# Altium project fpga_pmu_pcb_board.PrjPcb (part 1 of 2)
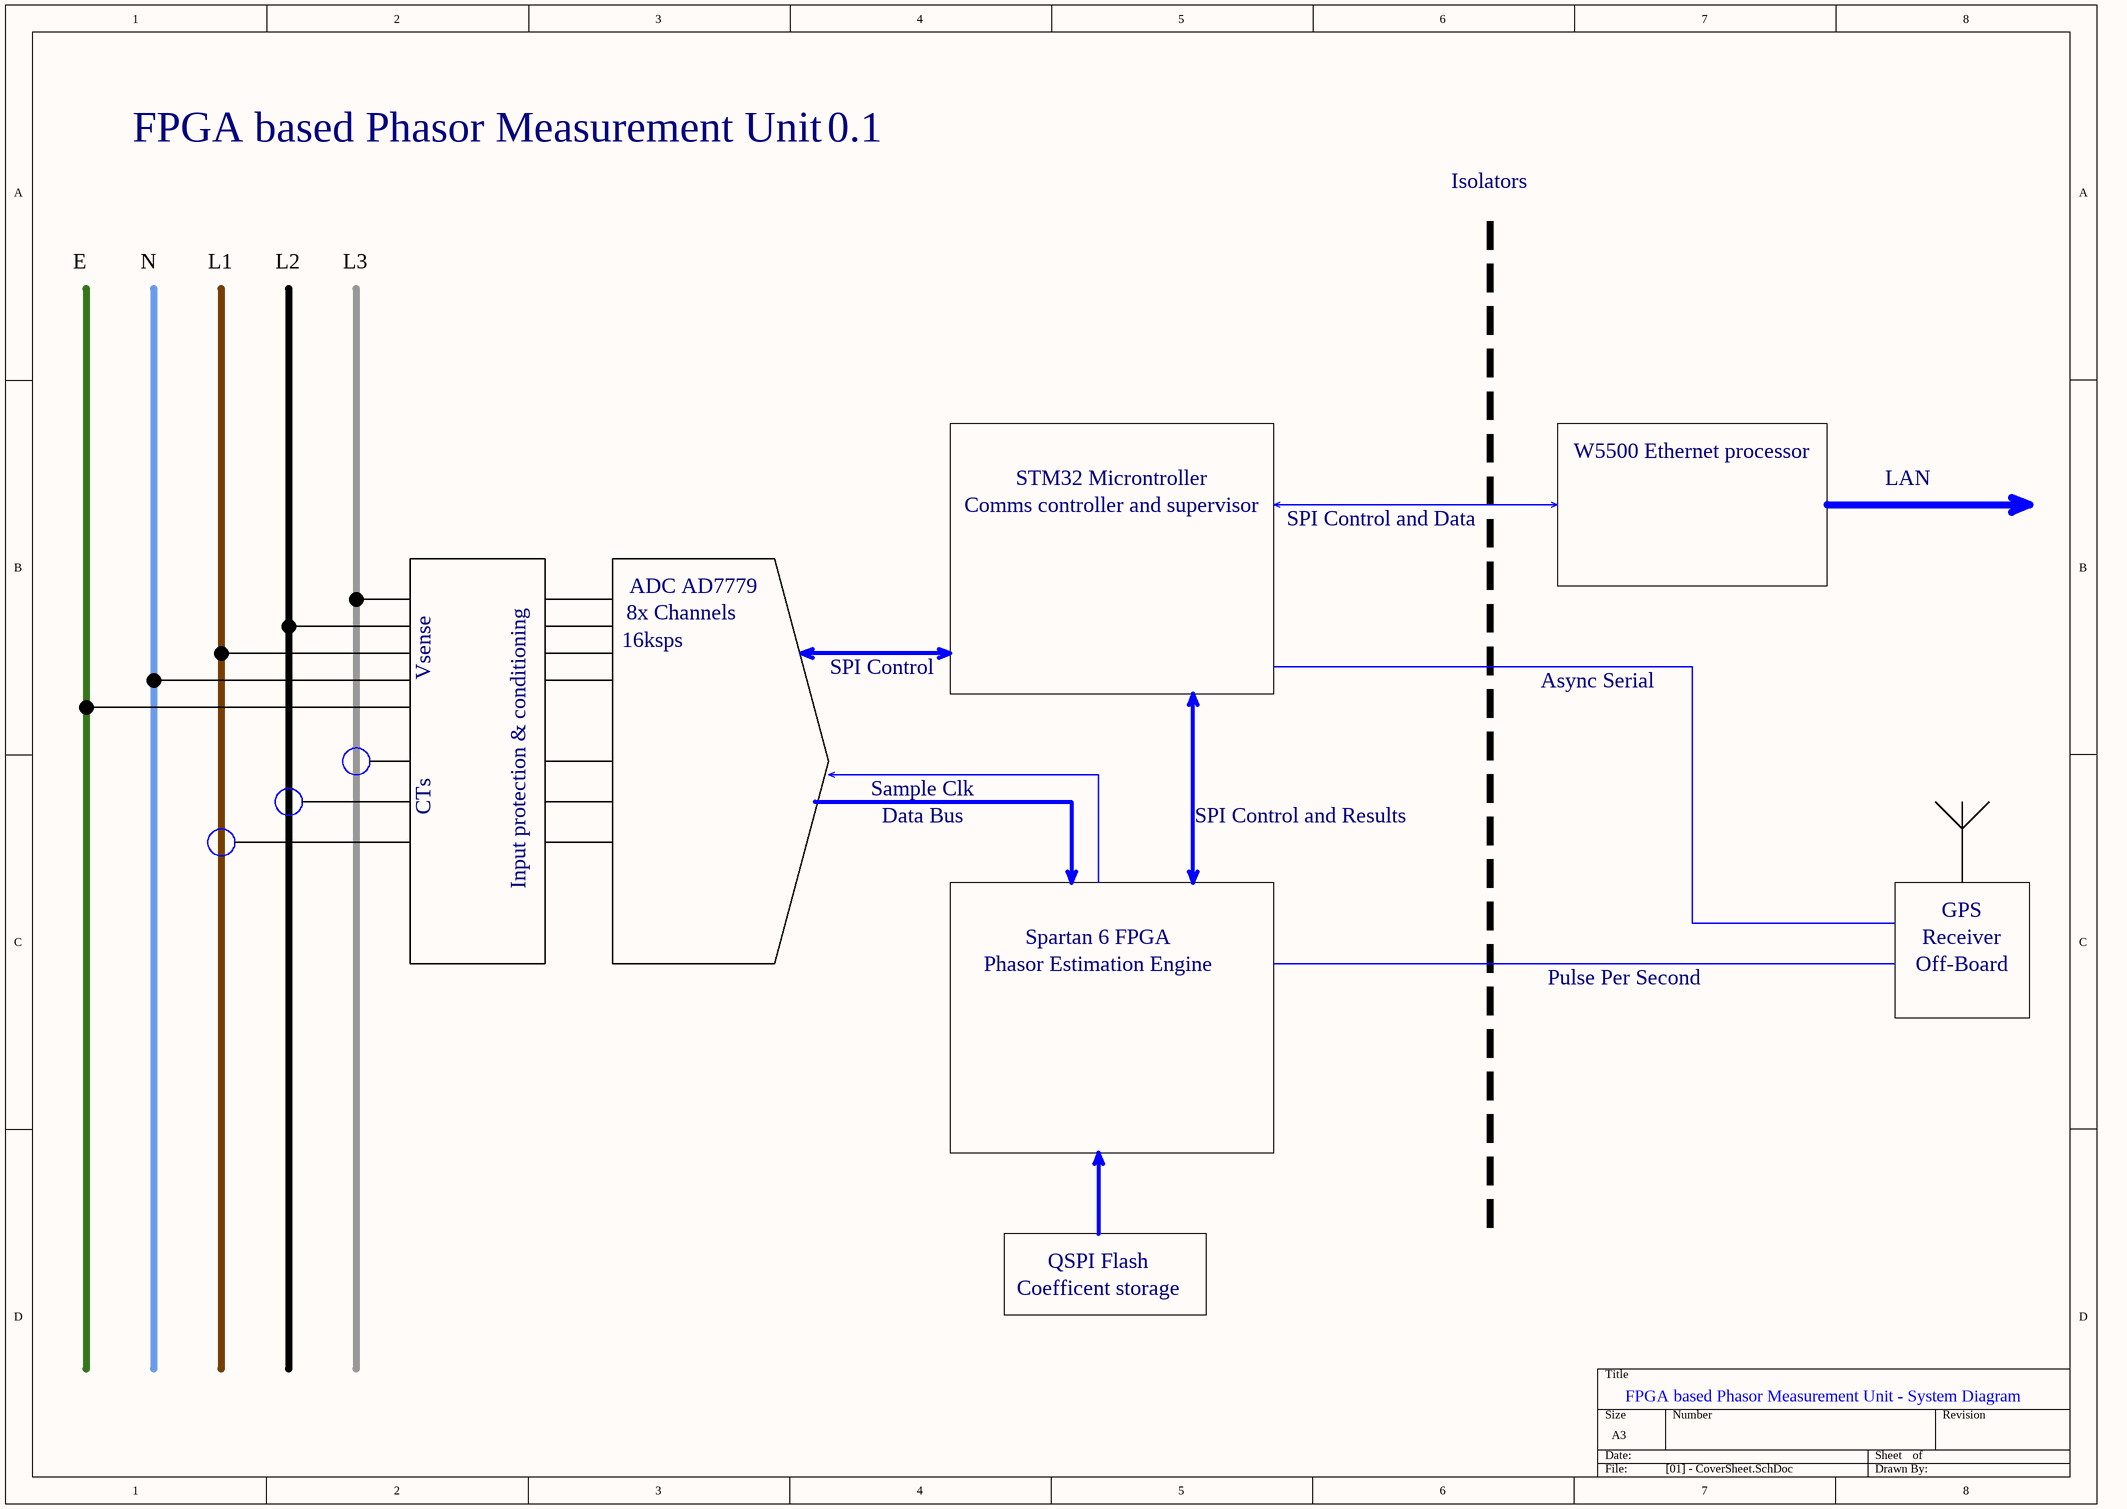
[diagram p0: [01] - CoverSheet.SchDoc]
ProjectName: FPGA PMU
10 sheets, 269 parts. Net scope: flat (ports and power ports of the same name join across sheets).
Board file: fpga_pmu_pcb_board.PcbDoc
Sheets:
  [01] - CoverSheet.SchDoc
  [02] - Notes.SchDoc
  [03] - HV Input.SchDoc
  [04] - Current Transformers.SchDoc
  [05] - ADC.SchDoc
  [06] - FPGA Aux.SchDoc
  [07] - FPGA IO.SchDoc
  [08] - Microcontroller.SchDoc
  [09] - Ethernet.SchDoc
  [10] - Isolation.SchDoc

## Sheet [01] - CoverSheet.SchDoc
size A3; Engineer: Derryn Harvie; Revision: 0.1; SheetNumber: 1

### Notes on the sheet
- FPGA based Phasor Measurement Unit
- Isolators
- E
- N
- L1
- L2
- L3
- W5500 Ethernet processor
- STM32 Microntroller
- Comms controller and supervisor
- SPI Control and Data
- LAN
- ADC AD7779
- 8x Channels
- 16ksps
- Vsense
- SPI Control
- Async Serial
- Input protection & conditioning
- Sample Clk
- CTs
- Data Bus
- SPI Control and Results
- GPS
- Spartan 6 FPGA
- Phasor Estimation Engine
- Pulse Per Second
- Receiver
- Off-Board
- QSPI Flash
- Coefficent storage
- FPGA based Phasor Measurement Unit - System Diagram

## Sheet [02] - Notes.SchDoc
size A4
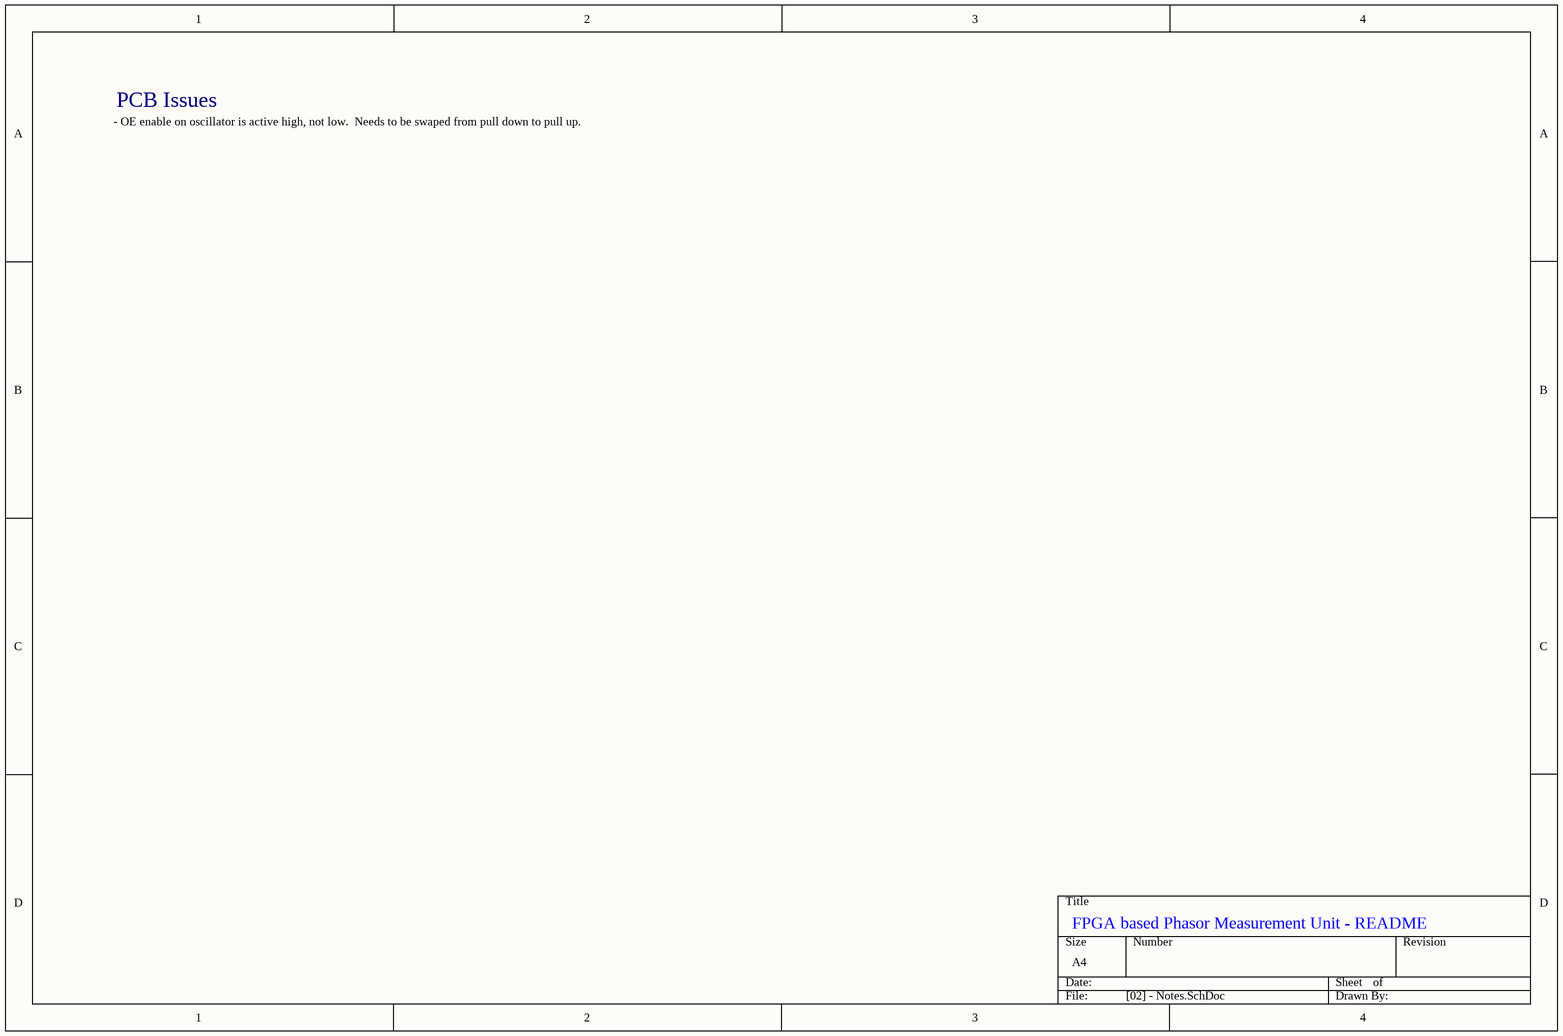
[diagram p1: [02] - Notes.SchDoc]

### Notes on the sheet
- PCB Issues
- - OE enable on oscillator is active high, not low.  Needs to be swaped from pull down to pull up.
- FPGA based Phasor Measurement Unit - README

## Sheet [03] - HV Input.SchDoc
size A3
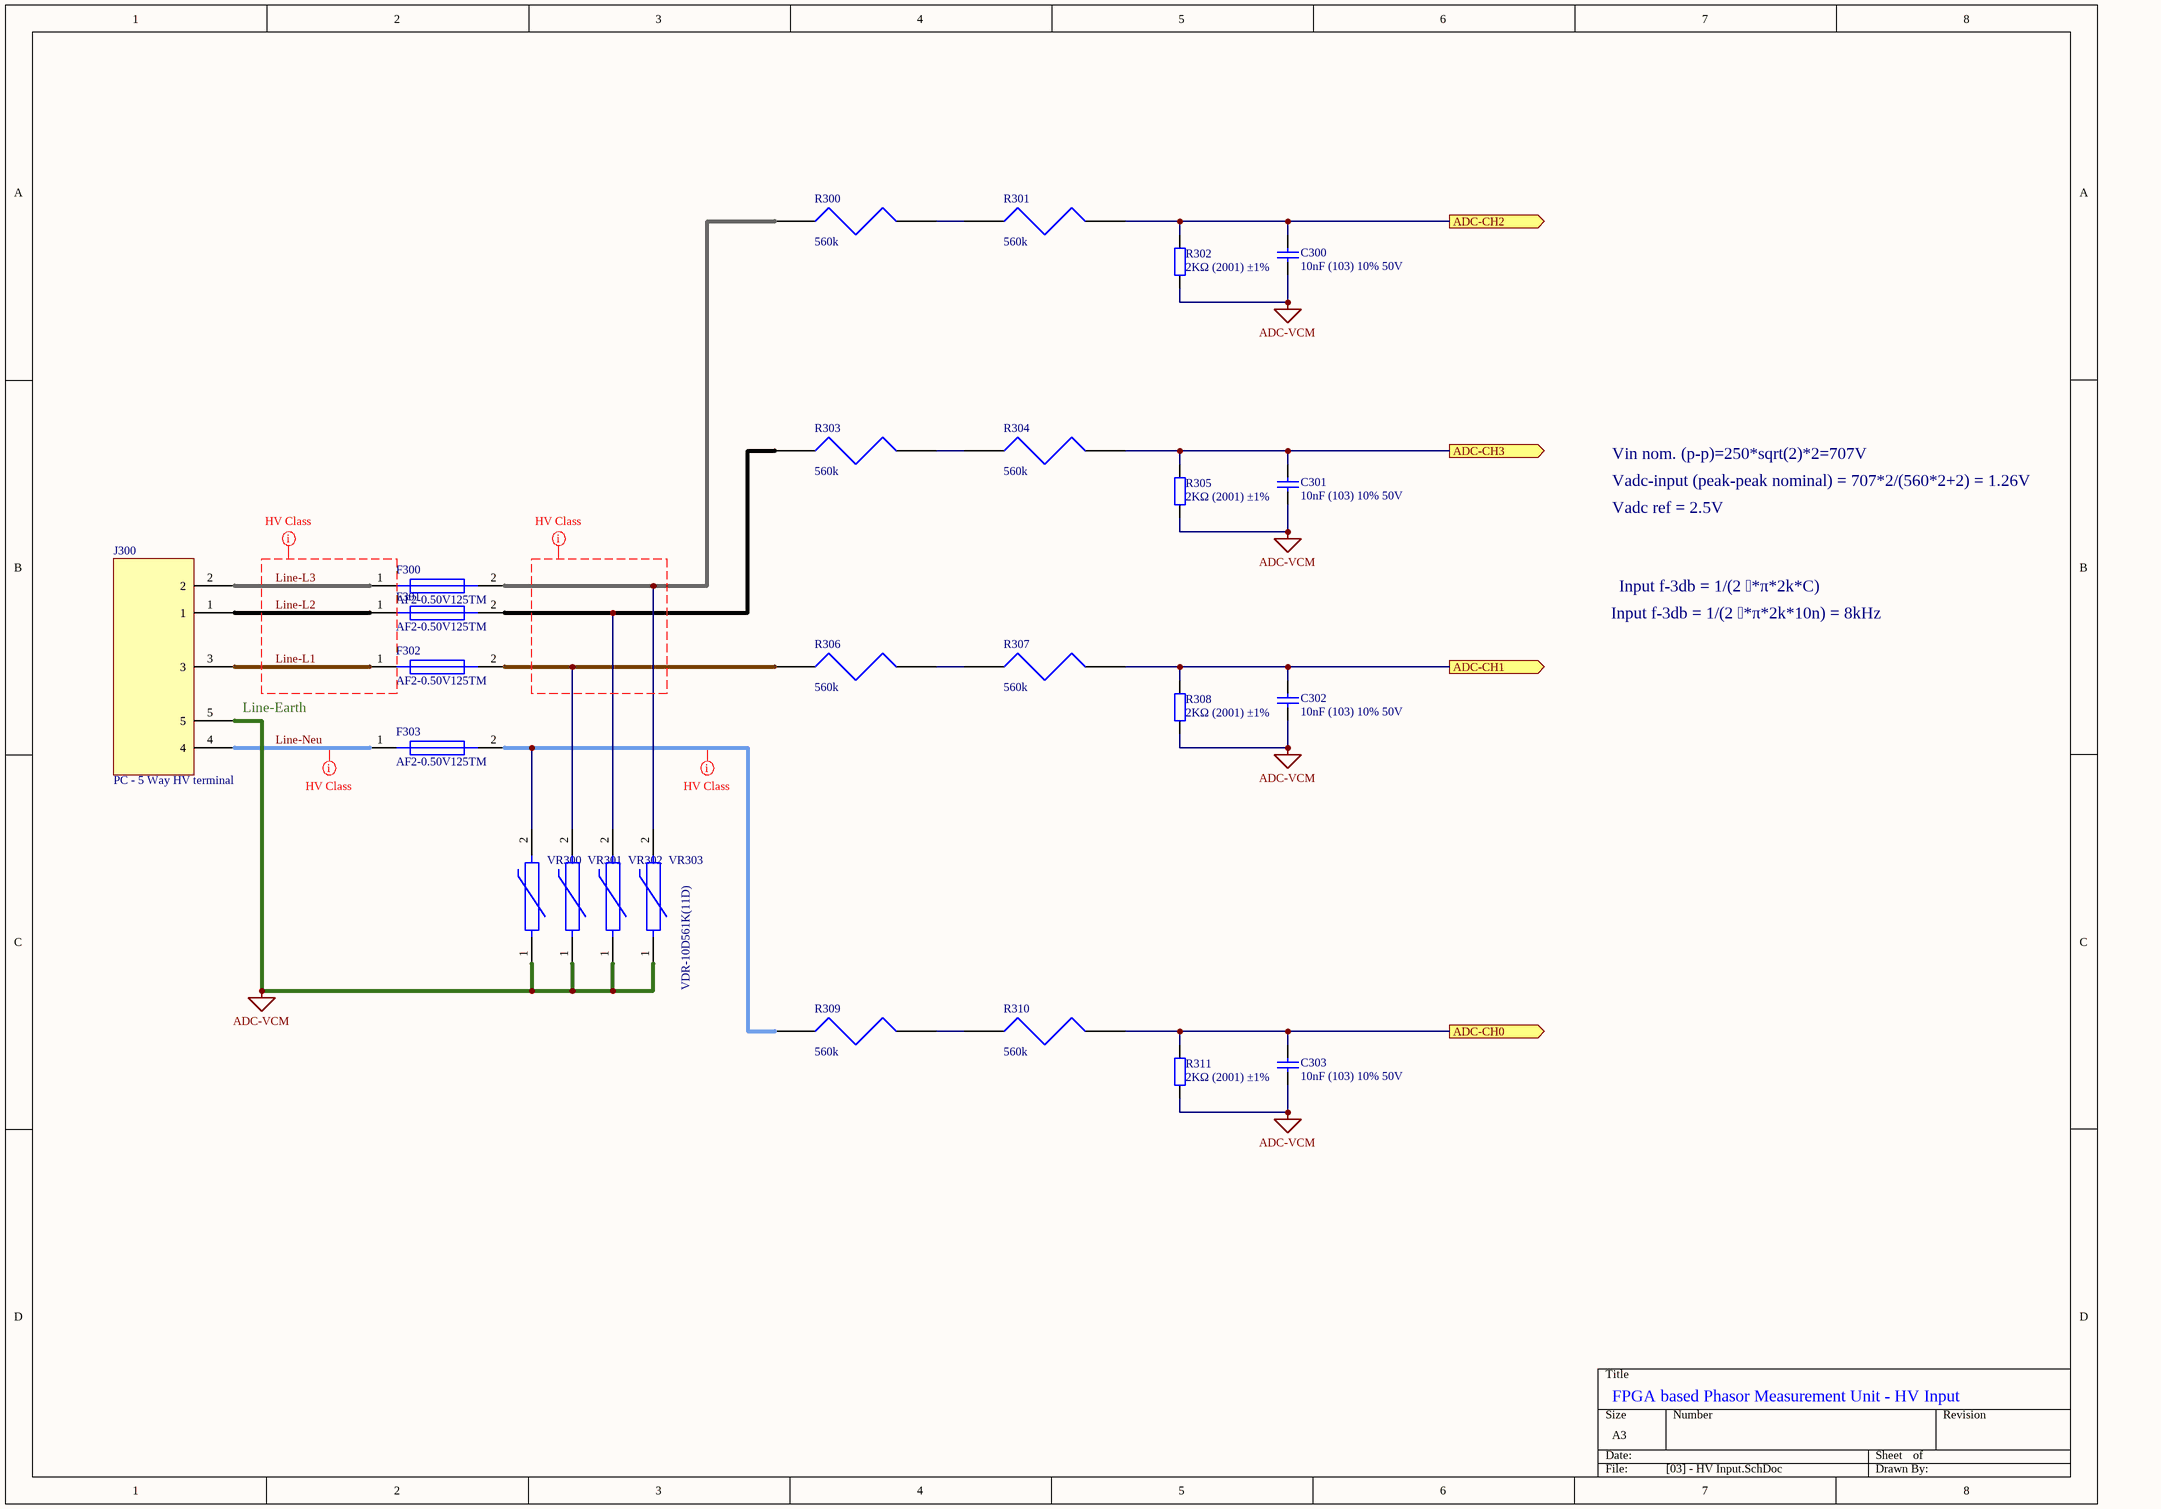
[diagram p2: [03] - HV Input.SchDoc]

### Parts
C300  10nF (103) 10% 50V  [0805_C]
C301  10nF (103) 10% 50V  [0805_C]
C302  10nF (103) 10% 50V  [0805_C]
C303  10nF (103) 10% 50V  [0805_C]
F300  AF2-0.50V125TM  [2410 Fuse]
F301  AF2-0.50V125TM  [2410 Fuse]
F302  AF2-0.50V125TM  [2410 Fuse]
F303  AF2-0.50V125TM  [2410 Fuse]
J300  PC - 5 Way HV terminal  [1017517]
R300  560k  [2512_HV_RES]
R301  560k  [2512_HV_RES]
R302  2KΩ (2001) ±1%  [0805_R]
R303  560k  [2512_HV_RES]
R304  560k  [2512_HV_RES]
R305  2KΩ (2001) ±1%  [0805_R]
R306  560k  [2512_HV_RES]
R307  560k  [2512_HV_RES]
R308  2KΩ (2001) ±1%  [0805_R]
R309  560k  [2512_HV_RES]
R310  560k  [2512_HV_RES]
R311  2KΩ (2001) ±1%  [0805_R]
VR300  VDR-10D561K(11D)  [VDR-10D561K(11D)]  (value not drawn)
VR301  VDR-10D561K(11D)  [VDR-10D561K(11D)]  (value not drawn)
VR302  VDR-10D561K(11D)  [VDR-10D561K(11D)]  (value not drawn)
VR303  VDR-10D561K(11D)  [VDR-10D561K(11D)]

### Ports
ADC-CH0 (out), ADC-CH1 (out), ADC-CH2 (out), ADC-CH3 (out)

### Nets
ADC-VCM: C300.1 C301.1 C302.1 C303.1 J300.5 R302.1 R305.1 R308.1 R311.1 VR300.1 VR301.1 VR302.1 VR303.1
Line-L1: F302.1 J300.3
Line-L2: F301.1 J300.1
Line-L3: F300.1 J300.2
Line-Neu: F303.1 J300.4
NetC300_2: C300.2 R301.2 R302.2 ; port ADC-CH2
NetC301_2: C301.2 R304.2 R305.2 ; port ADC-CH3
NetC302_2: C302.2 R307.2 R308.2 ; port ADC-CH1
NetC303_2: C303.2 R310.2 R311.2 ; port ADC-CH0
NetF300_2: F300.2 R300.1 VR303.2
NetF301_2: F301.2 R303.1 VR302.2
NetF302_2: F302.2 R306.1 VR301.2
NetF303_2: F303.2 R309.1 VR300.2
NetR300_2: R300.2 R301.1
NetR303_2: R303.2 R304.1
NetR306_2: R306.2 R307.1
NetR309_2: R309.2 R310.1

### Layout directives
net class HV: (no net found under the mark), Line-L1, Line-L2, Line-L3, Line-Neu, NetF303_2

### Notes on the sheet
- Vin nom. (p-p)=250*sqrt(2)*2=707V
- Vadc-input (peak-peak nominal) = 707*2/(560*2+2) = 1.26V
- Vadc ref = 2.5V
- Input f-3db = 1/(2 *π*2k*C)
- Input f-3db = 1/(2 *π*2k*10n) = 8kHz
- (near J300) Line-Earth
- FPGA based Phasor Measurement Unit - HV Input

### Library data of the parts
C300-C303 = 0805 10nF (103) 10% 50V: 贴片电容; ComponentLink1Description: 供应商链接; ComponentLink1URL: http://www.szlcsc.com/product/details_2062.html; Package: 0805; Supplier: LC; SuppliersPartNumber: C1710
F300-F303 = AF2-0.50V125TM: Chip Fuse Fast Blow 500mA 231mΩ 100A AC，50A DC 0.1 2410 Surface Mount Fuses RoHS; SuppliersPartNo: C311009; JLCPCB: NO
J300 = PC - 5 Way HV terminal: TDPT 4/ 5-SC-6,35-ZB - 1017517; JLCPCB: NO
R300 R301 R303 R304 R306 R307 R309 R310 = HR2512F560KE04Z: HIGH VOLTAGE RESISTOR 560KOHMS ±1% 1W 2512 ROHS; Value: 560k; Supplier: LCSC; SuppliersPartNumber: C175529
R302 R305 R308 R311 = 0805 2KΩ (2001) 1%: 贴片电阻; ComponentLink1Description: 供应商链接; ComponentLink1URL: http://www.szlcsc.com/product/details_18292.html; Package: 0805; Supplier: LC; SuppliersPartNumber: C17604
VR300-VR303 = VDR-10D561K(11D): 460V 920V 2.5KA 560V Through Hole Varistors RoHS; SuppliersPartNo: C283943; JLCPCB: NO

## Sheet [04] - Current Transformers.SchDoc
size A3
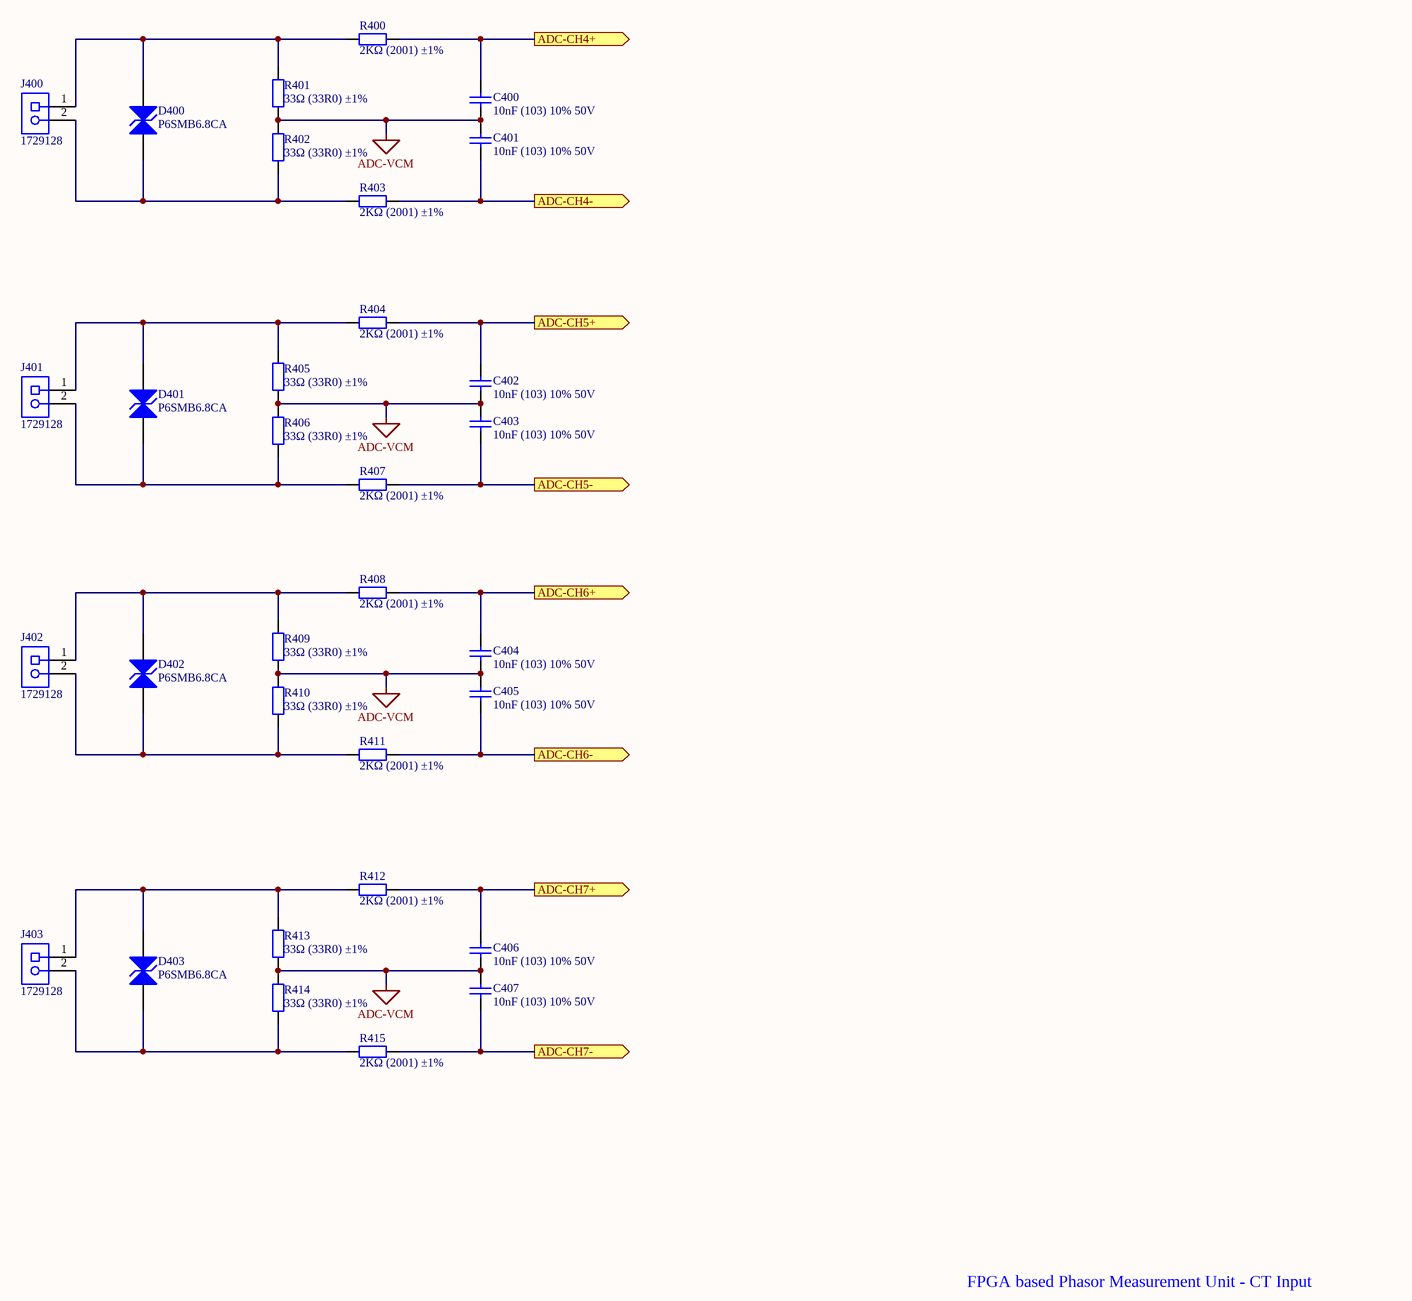
[diagram p3: [04] - Current Transformers.SchDoc]

### Parts
C400  10nF (103) 10% 50V  [0805_C]
C401  10nF (103) 10% 50V  [0805_C]
C402  10nF (103) 10% 50V  [0805_C]
C403  10nF (103) 10% 50V  [0805_C]
C404  10nF (103) 10% 50V  [0805_C]
C405  10nF (103) 10% 50V  [0805_C]
C406  10nF (103) 10% 50V  [0805_C]
C407  10nF (103) 10% 50V  [0805_C]
D400  P6SMB6.8CA  [SMB(DO-214AA)_S1]
D401  P6SMB6.8CA  [SMB(DO-214AA)_S1]
D402  P6SMB6.8CA  [SMB(DO-214AA)_S1]
D403  P6SMB6.8CA  [SMB(DO-214AA)_S1]
J400  1729128  [PHOE-1729128-2_V]
J401  1729128  [PHOE-1729128-2_V]
J402  1729128  [PHOE-1729128-2_V]
J403  1729128  [PHOE-1729128-2_V]
R400  2KΩ (2001) ±1%  [0805_R]
R401  33Ω (33R0) ±1%  [0603_R]
R402  33Ω (33R0) ±1%  [0603_R]
R403  2KΩ (2001) ±1%  [0805_R]
R404  2KΩ (2001) ±1%  [0805_R]
R405  33Ω (33R0) ±1%  [0603_R]
R406  33Ω (33R0) ±1%  [0603_R]
R407  2KΩ (2001) ±1%  [0805_R]
R408  2KΩ (2001) ±1%  [0805_R]
R409  33Ω (33R0) ±1%  [0603_R]
R410  33Ω (33R0) ±1%  [0603_R]
R411  2KΩ (2001) ±1%  [0805_R]
R412  2KΩ (2001) ±1%  [0805_R]
R413  33Ω (33R0) ±1%  [0603_R]
R414  33Ω (33R0) ±1%  [0603_R]
R415  2KΩ (2001) ±1%  [0805_R]

### Ports
ADC-CH4+ (out), ADC-CH4- (out), ADC-CH5+ (out), ADC-CH5- (out), ADC-CH6+ (out), ADC-CH6- (out), ADC-CH7+ (out), ADC-CH7- (out)

### Nets
ADC-VCM: C400.1 C401.2 C402.1 C403.2 C404.1 C405.2 C406.1 C407.2 R401.1 R402.2 R405.1 R406.2 R409.1 R410.2 R413.1 R414.2
NetC400_2: C400.2 R400.1 ; port ADC-CH4+
NetC401_1: C401.1 R403.1 ; port ADC-CH4-
NetC402_2: C402.2 R404.1 ; port ADC-CH5+
NetC403_1: C403.1 R407.1 ; port ADC-CH5-
NetC404_2: C404.2 R408.1 ; port ADC-CH6+
NetC405_1: C405.1 R411.1 ; port ADC-CH6-
NetC406_2: C406.2 R412.1 ; port ADC-CH7+
NetC407_1: C407.1 R415.1 ; port ADC-CH7-
NetD400_1: D400.1(A) J400.2 R402.1 R403.2
NetD400_2: D400.2(K) J400.1 R400.2 R401.2
NetD401_1: D401.1(A) J401.2 R406.1 R407.2
NetD401_2: D401.2(K) J401.1 R404.2 R405.2
NetD402_1: D402.1(A) J402.2 R410.1 R411.2
NetD402_2: D402.2(K) J402.1 R408.2 R409.2
NetD403_1: D403.1(A) J403.2 R414.1 R415.2
NetD403_2: D403.2(K) J403.1 R412.2 R413.2

### Notes on the sheet
- FPGA based Phasor Measurement Unit - CT Input

### Library data of the parts
C400-C407 = 0805 10nF (103) 10% 50V: 贴片电容; ComponentLink1Description: 供应商链接; ComponentLink1URL: http://www.szlcsc.com/product/details_2062.html; Package: 0805; Supplier: LC; SuppliersPartNumber: C1710
D400-D403 = SMB/DO-214AA P6SMB6.8CA: TVS; ComponentLink1Description: 供应商链接; ComponentLink1URL: http://www.szlcsc.com/product/details_79530.html; Package: SMB/DO-214AA; Supplier: LC; SuppliersPartNumber: C78395
J400-J403 = CMP-2000-05815-1: PCB Terminal Block, 13.5 A, 400 V, 2-Pin THD, RoHS, Bulk; Manufacturer: Phoenix Contact; Package Version: 03/2015; No. of Rows: 1; Pitch: 5.08mm; No. of Positions: 2; Voltage Rating: 400V; Current Rating: 13500mA; Manufacturer URL: http://www.phoenixcontact.com/; Datasheet URL: https://datasheet.ciiva.com/16046/1729128-16046181.pdf; RoHS: TRUE; Package URL: https://www.phoenixcontact.com/online/portal/pi/pxc/product_detail_page/!ut/p/b1/3VdJjqNKFDxLH8AFycySyWY2ozFsEPOMMQaDOX1XedGL_1Vdm5YXJleknhSKeBkvI6EA8ncAo3AYoDhBQGco6KN7VURTdemj9us_IEKEZo_YHiPAEWEFmDGOHMORkqKYCORBZxgL7ZoaZYcbFFUZ3fqxSY6GOuxydWUuHqz1ynmMFygu583Bob0Ewr6Sd_l-5m-kAueHiB0jpRwZwe58wwtkpxtMYd_LmGcDRU02dRNEyWt6Y2ti5pSyJ_reIkzIulrqApdnbT11V5jnCKbYNCvhEM1MCpPByat_X379-iThf08CI5GfOPqfBeS3BRoBOdD55AKVv0iLwCMq-2BrzXWSGRH7pUGD9uwXQjiph3xL0DKQwdGa0JImiIOmBNOestqgwTHSSs2oOep-78apyXQBvNi8ZLaFjvjWvcaUEBu0MC6Wbe-d6mB0FAebo2lUWinqYaZs5DAYzV0RP9yitUjnGJ0iI9xhZkT42OCQNUJJhkgWINNQLP2JFP6OpMg3JCVg70jqHT0lvKOnhHf0lPuOnnLf0VPuWx6_dxwUIvwk5WMkT0kLL1mh61l2yZVSzG3pYV_bqo-mj6uMKwKwdnnW8Jh5RTOJzMOA5c-eJDaZQw4mTMPH02PvS_ZAqNVjVTo2WyYLkwH_KU1mmmG5kjRhDqPXLwwVHvVOjCM60-fpXvTDfMGW1PVFVS1r4e4yVDk4ZdNbkUHvqPqQSeian4UD39fNKmachqdJ1NJbyk8rXT9mXTvPk3oE5meulKGgiruPJek-4I9hTT6G8ZLOyRSm2RRVbThERQad5OS28hdt4YW4vG0stgYYzsWsK4_7y6DZMjJSCqri1kyiZR5vD7pwIrNR7QwPHTcLTI5qT7eRlpHrdGiupYlqQDJ7zy_CND8fWWBoLRXxk1RVcXiBQwbTD4Xi7KL-FuO94t9xaqweXzH; PartNumber: 1729128; Package Description: 2-Pin Through Hole Device, Body 8.1 x 10.16 mm, Pitch 5.08 mm; Datasheet Version: 12/2013; Mounting Technology: ThroughHole; Orientation: Horizontal; Package Reference: 1729128-2; Packing: Bulk; JLCPCB: NO
R400 R403 R404 R407 R408 R411 R412 R415 = 0805 2KΩ (2001) 1%: 贴片电阻; ComponentLink1Description: 供应商链接; ComponentLink1URL: http://www.szlcsc.com/product/details_18292.html; Package: 0805; Supplier: LC; SuppliersPartNumber: C17604
R401 R402 R405 R406 R409 R410 R413 R414 = 0603 33Ω (33R0) 1%: 贴片电阻; ComponentLink1Description: 供应商链接; ComponentLink1URL: http://www.szlcsc.com/product/details_23867.html; Package: 0603; Supplier: LC; SuppliersPartNumber: C23140

## Sheet [05] - ADC.SchDoc
size A3
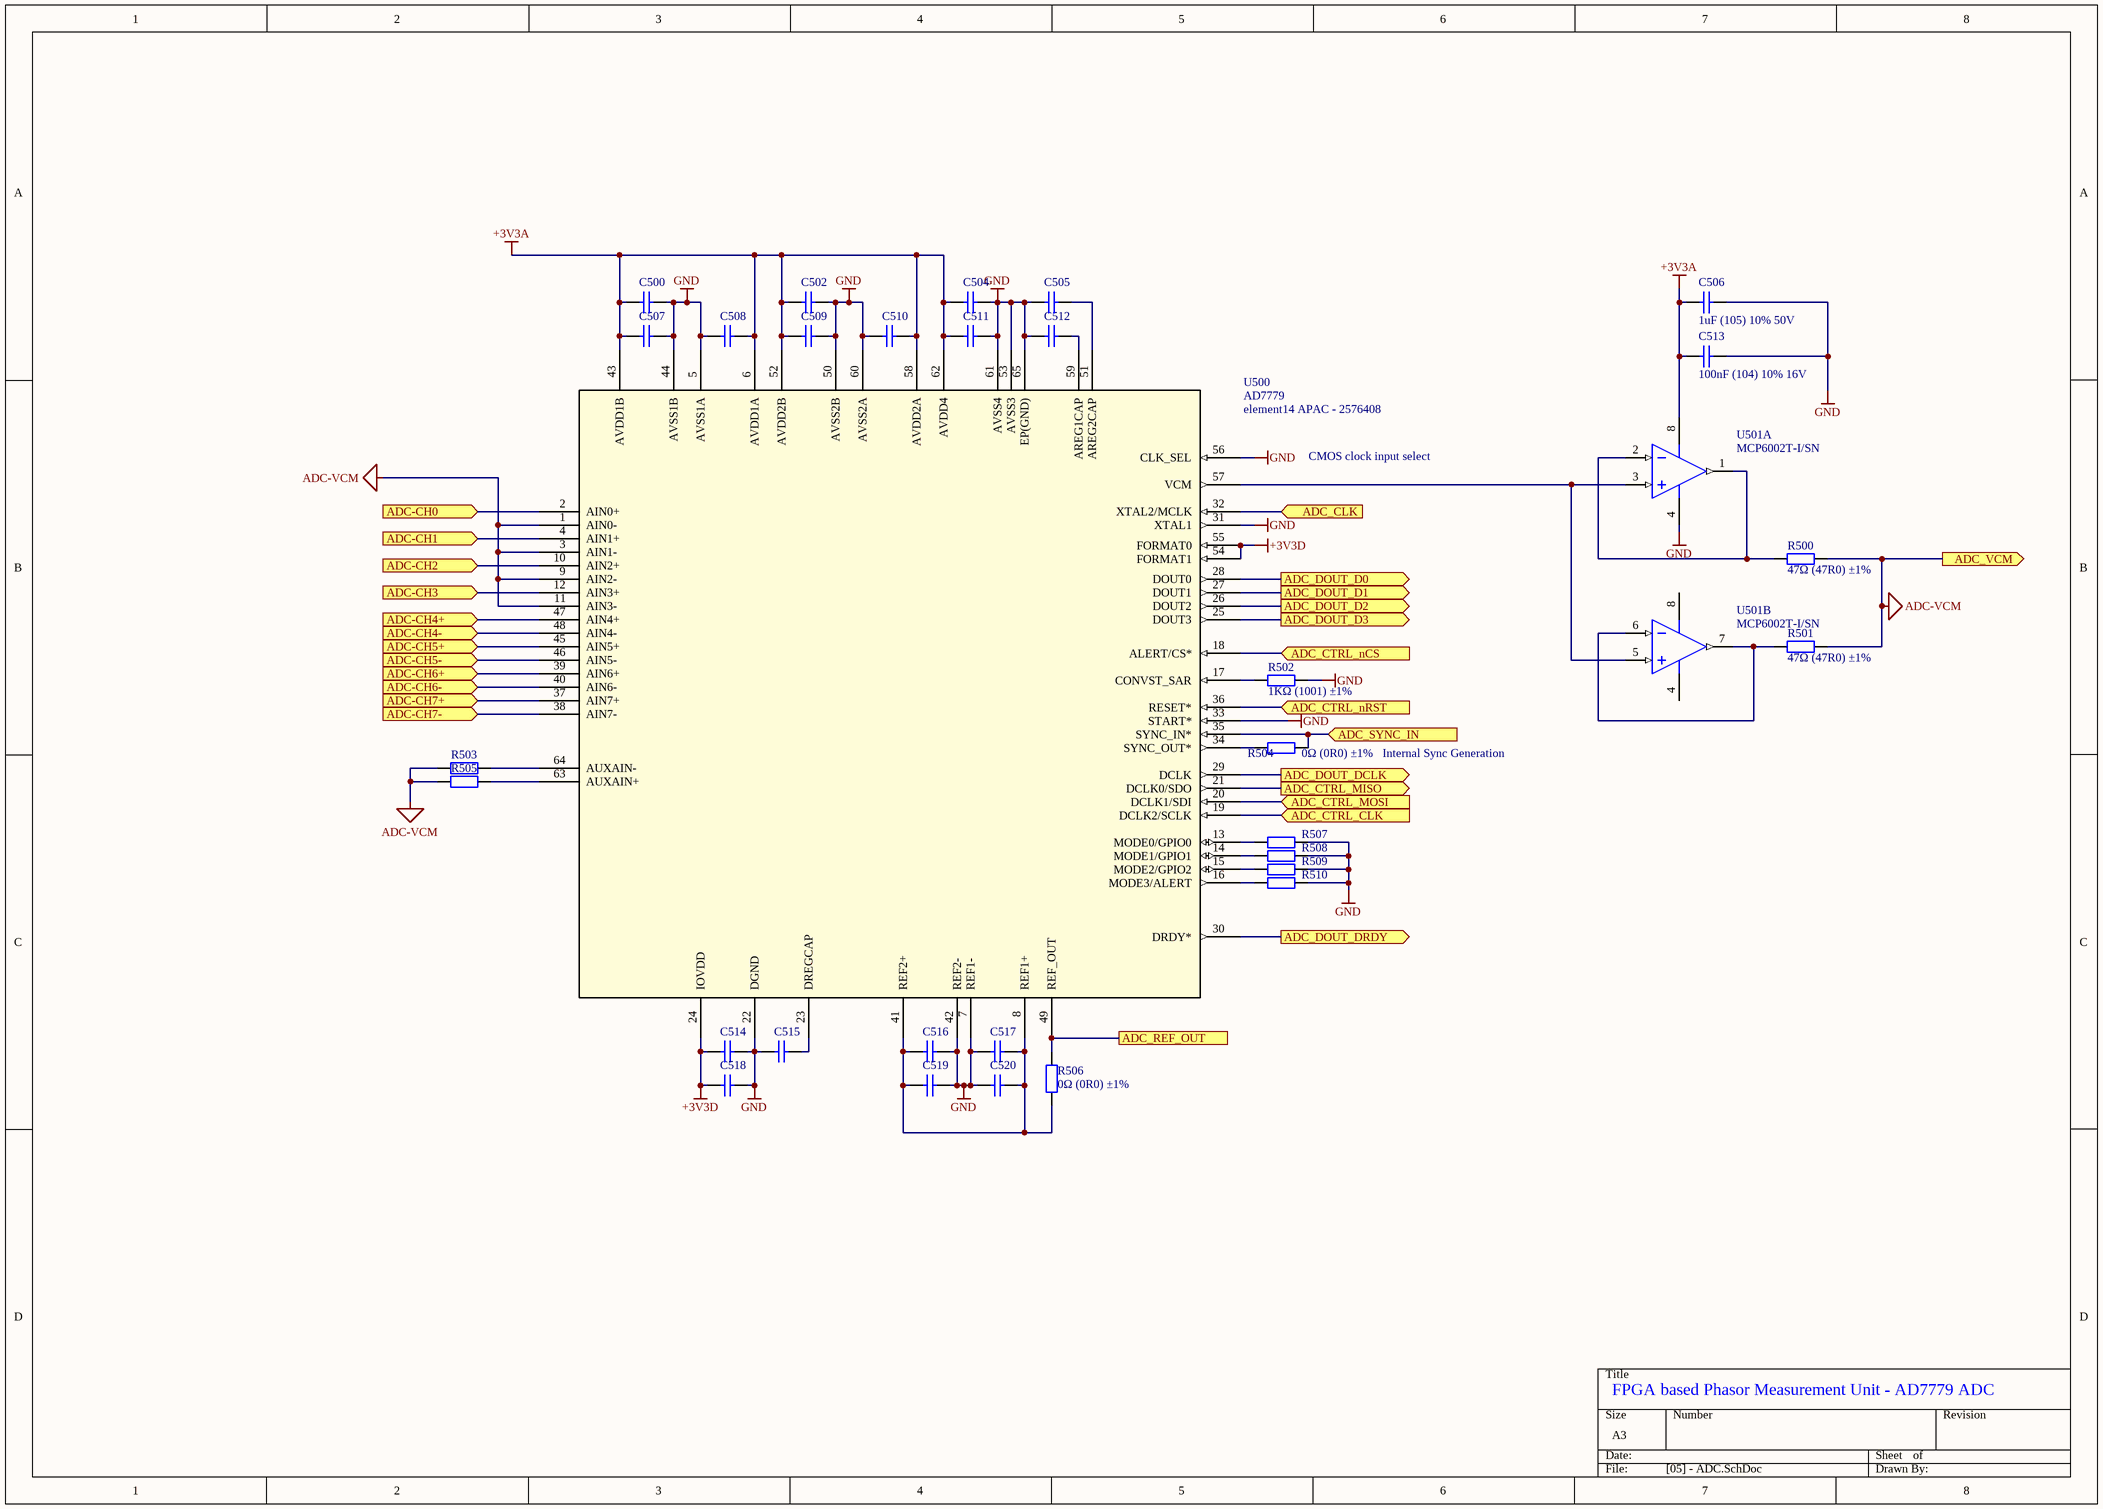
[diagram p4: [05] - ADC.SchDoc]

### Parts
C500  1uF (105) 10% 50V  [0603_C]  (value not drawn)
C502  1uF (105) 10% 50V  [0603_C]  (value not drawn)
C504  1uF (105) 10% 50V  [0603_C]  (value not drawn)
C505  100nF (104) 10% 16V  [0402_C]  (value not drawn)
C506  1uF (105) 10% 50V  [0603_C]
C507  100nF (104) 10% 16V  [0402_C]  (value not drawn)
C508  100nF (104) 10% 16V  [0402_C]  (value not drawn)
C509  100nF (104) 10% 16V  [0402_C]  (value not drawn)
C510  100nF (104) 10% 16V  [0402_C]  (value not drawn)
C511  100nF (104) 10% 16V  [0402_C]  (value not drawn)
C512  100nF (104) 10% 16V  [0402_C]  (value not drawn)
C513  100nF (104) 10% 16V  [0402_C]
C514  100nF (104) 10% 16V  [0402_C]  (value not drawn)
C515  100nF (104) 10% 16V  [0402_C]  (value not drawn)
C516  100nF (104) 10% 16V  [0402_C]  (value not drawn)
C517  100nF (104) 10% 16V  [0402_C]  (value not drawn)
C518  1uF (105) 10% 50V  [0603_C]  (value not drawn)
C519  1uF (105) 10% 50V  [0603_C]  (value not drawn)
C520  1uF (105) 10% 50V  [0603_C]  (value not drawn)
R500  47Ω (47R0) ±1%  [0603_R]
R501  47Ω (47R0) ±1%  [0603_R]
R502  1KΩ (1001) ±1%  [0402_R]
R503  1KΩ (1001) ±1%  [0402_R]  (value not drawn)
R504  0Ω (0R0) ±1%  [0402_R]
R505  1KΩ (1001) ±1%  [0402_R]  (value not drawn)
R506  0Ω (0R0) ±1%  [0402_R]
R507  1KΩ (1001) ±1%  [0402_R]  (value not drawn)
R508  1KΩ (1001) ±1%  [0402_R]  (value not drawn)
R509  1KΩ (1001) ±1%  [0402_R]  (value not drawn)
R510  1KΩ (1001) ±1%  [0402_R]  (value not drawn)
U500  AD7779  Supplier Part Number 1: element14 APAC - 2576408  [CP_64_15]
U501  MCP6002T-I/SN  [SOIC-8_150mil]  (parts A,B of 2)

### Ports
ADC-CH0 (in), ADC-CH1 (in), ADC-CH2 (in), ADC-CH3 (in), ADC-CH4+ (in), ADC-CH4- (in), ADC-CH5+ (in), ADC-CH5- (in), ADC-CH6+ (in), ADC-CH6- (in), ADC-CH7+ (in), ADC-CH7- (in), ADC_CLK (in), ADC_CTRL_CLK (in), ADC_CTRL_MISO (out), ADC_CTRL_MOSI (in), ADC_CTRL_nCS (in), ADC_CTRL_nRST (in), ADC_DOUT_D0 (out), ADC_DOUT_D1 (out), ADC_DOUT_D2 (out), ADC_DOUT_D3 (out), ADC_DOUT_DCLK (out), ADC_DOUT_DRDY (out), ADC_REF_OUT, ADC_SYNC_IN (in), ADC_VCM (out)

### Nets
+3V3A: C500.1 C502.1 C504.1 C506.1 C507.1 C508.2 C509.1 C510.2 C511.1 C513.1 U500.6(AVDD1A) U500.43(AVDD1B) U500.52(AVDD2B) U500.58(AVDD2A) U500.62(AVDD4) U501.8(VDD)
+3V3D: C514.1 C518.1 U500.24(IOVDD) U500.54(FORMAT1) U500.55(FORMAT0)
ADC-VCM: R500.2 R501.2 R503.1 R505.1 U500.1(AIN0-) U500.3(AIN1-) U500.9(AIN2-) U500.11(AIN3-) ; port ADC_VCM
GND: C500.2 C502.2 C504.2 C505.1 C506.2 C507.2 C508.1 C509.2 C510.1 C511.2 C512.1 C513.2 C514.2 C515.1 C516.2 C517.1 C518.2 C519.2 C520.1 R502.2 R507.2 R508.2 R509.2 R510.2 U500.5(AVSS1A) U500.7(REF1-) U500.22(DGND) U500.31(XTAL1) U500.33(START*) U500.42(REF2-) U500.44(AVSS1B) U500.50(AVSS2B) U500.53(AVSS3) U500.56(CLK_SEL) U500.60(AVSS2A) U500.61(AVSS4) U500.65(EP(GND)) U501.4(VSS)
NetC300_2: U500.10(AIN2+) ; port ADC-CH2
NetC301_2: U500.12(AIN3+) ; port ADC-CH3
NetC302_2: U500.4(AIN1+) ; port ADC-CH1
NetC303_2: U500.2(AIN0+) ; port ADC-CH0
NetC400_2: U500.47(AIN4+) ; port ADC-CH4+
NetC401_1: U500.48(AIN4-) ; port ADC-CH4-
NetC402_2: U500.45(AIN5+) ; port ADC-CH5+
NetC403_1: U500.46(AIN5-) ; port ADC-CH5-
NetC404_2: U500.39(AIN6+) ; port ADC-CH6+
NetC405_1: U500.40(AIN6-) ; port ADC-CH6-
NetC406_2: U500.37(AIN7+) ; port ADC-CH7+
NetC407_1: U500.38(AIN7-) ; port ADC-CH7-
NetC505_2: C505.2 U500.51(AREG2CAP)
NetC512_2: C512.2 U500.59(AREG1CAP)
NetC515_2: C515.2 U500.23(DREGCAP)
NetC516_1: C516.1 C517.2 C519.1 C520.2 R506.1 U500.8(REF1+) U500.41(REF2+)
NetR500_1: R500.1 U501.1(VOUTA) U501.2(VINA-)
NetR501_1: R501.1 U501.6(VINB-) U501.7(VOUTB)
NetR502_1: R502.1 U500.17(CONVST_SAR)
NetR503_2: R503.2 U500.64(AUXAIN-)
NetR504_1: R504.1 U500.34(SYNC_OUT*)
NetR504_2: R504.2 U500.35(SYNC_IN*) ; port ADC_SYNC_IN
NetR505_2: R505.2 U500.63(AUXAIN+)
NetR506_2: R506.2 U500.49(REF_OUT) ; port ADC_REF_OUT
NetR507_1: R507.1 U500.13(MODE0/GPIO0)
NetR508_1: R508.1 U500.14(MODE1/GPIO1)
NetR509_1: R509.1 U500.15(MODE2/GPIO2)
NetR510_1: R510.1 U500.16(MODE3/ALERT)
NetU500_18: U500.18(ALERT/CS*) ; port ADC_CTRL_nCS
NetU500_19: U500.19(DCLK2/SCLK) ; port ADC_CTRL_CLK
NetU500_20: U500.20(DCLK1/SDI) ; port ADC_CTRL_MOSI
NetU500_21: U500.21(DCLK0/SDO) ; port ADC_CTRL_MISO
NetU500_25: U500.25(DOUT3) ; port ADC_DOUT_D3
NetU500_26: U500.26(DOUT2) ; port ADC_DOUT_D2
NetU500_27: U500.27(DOUT1) ; port ADC_DOUT_D1
NetU500_28: U500.28(DOUT0) ; port ADC_DOUT_D0
NetU500_29: U500.29(DCLK) ; port ADC_DOUT_DCLK
NetU500_30: U500.30(DRDY*) ; port ADC_DOUT_DRDY
NetU500_32: U500.32(XTAL2/MCLK) ; port ADC_CLK
NetU500_36: U500.36(RESET*) ; port ADC_CTRL_nRST
NetU500_57: U500.57(VCM) U501.3(VINA+) U501.5(VINB+)

### Notes on the sheet
- CMOS clock input select
- Internal Sync Generation
- FPGA based Phasor Measurement Unit - AD7779 ADC

### Library data of the parts
C500 C502 C504 C506 C518-C520 = 0603 1uF (105) 10% 50V: 贴片电容; ComponentLink1Description: 供应商链接; ComponentLink1URL: http://www.szlcsc.com/product/details_16531.html; Package: 0603; Supplier: LC; SuppliersPartNumber: C15849
C505 C507-C517 = 0402 100nF (104) 10% 16V: 贴片电容; ComponentLink1Description: 供应商链接; ComponentLink1URL: http://www.szlcsc.com/product/details_1877.html; Package: 0402; Supplier: LC; SuppliersPartNumber: C1525
R500 R501 = 0603 47Ω (47R0) 1%: 贴片电阻; ComponentLink1Description: 供应商链接; ComponentLink1URL: http://www.szlcsc.com/product/details_23909.html; Package: 0603; Supplier: LC; SuppliersPartNumber: C23182
R502 R503 R505 R507-R510 = 0402 1KΩ (1001) 1%: 贴片电阻; ComponentLink1Description: 供应商链接; ComponentLink1URL: http://www.szlcsc.com/product/details_12256.html; Package: 0402; Supplier: LC; SuppliersPartNumber: C11702
R504 R506 = 0402 0Ω (0R0) 1%: 贴片电阻; ComponentLink1Description: 供应商链接; ComponentLink1URL: http://www.szlcsc.com/product/details_17853.html; Package: 0402; Supplier: LC; SuppliersPartNumber: C17168
U500 = AD7779ACPZ: ADC - 8 Channel; Supplier 1: Octopart; JLCPCB: NO
U501 = MCP6002T-I/SN_[C7377]: 运放; ComponentLink1Description: 供应商链接; ComponentLink1URL: http://www.szlcsc.com/product/details_7854.html; Package: SOIC-8_150mil; Supplier: LC; SuppliersPartNumber: C7377

## Sheet [06] - FPGA Aux.SchDoc
size A3
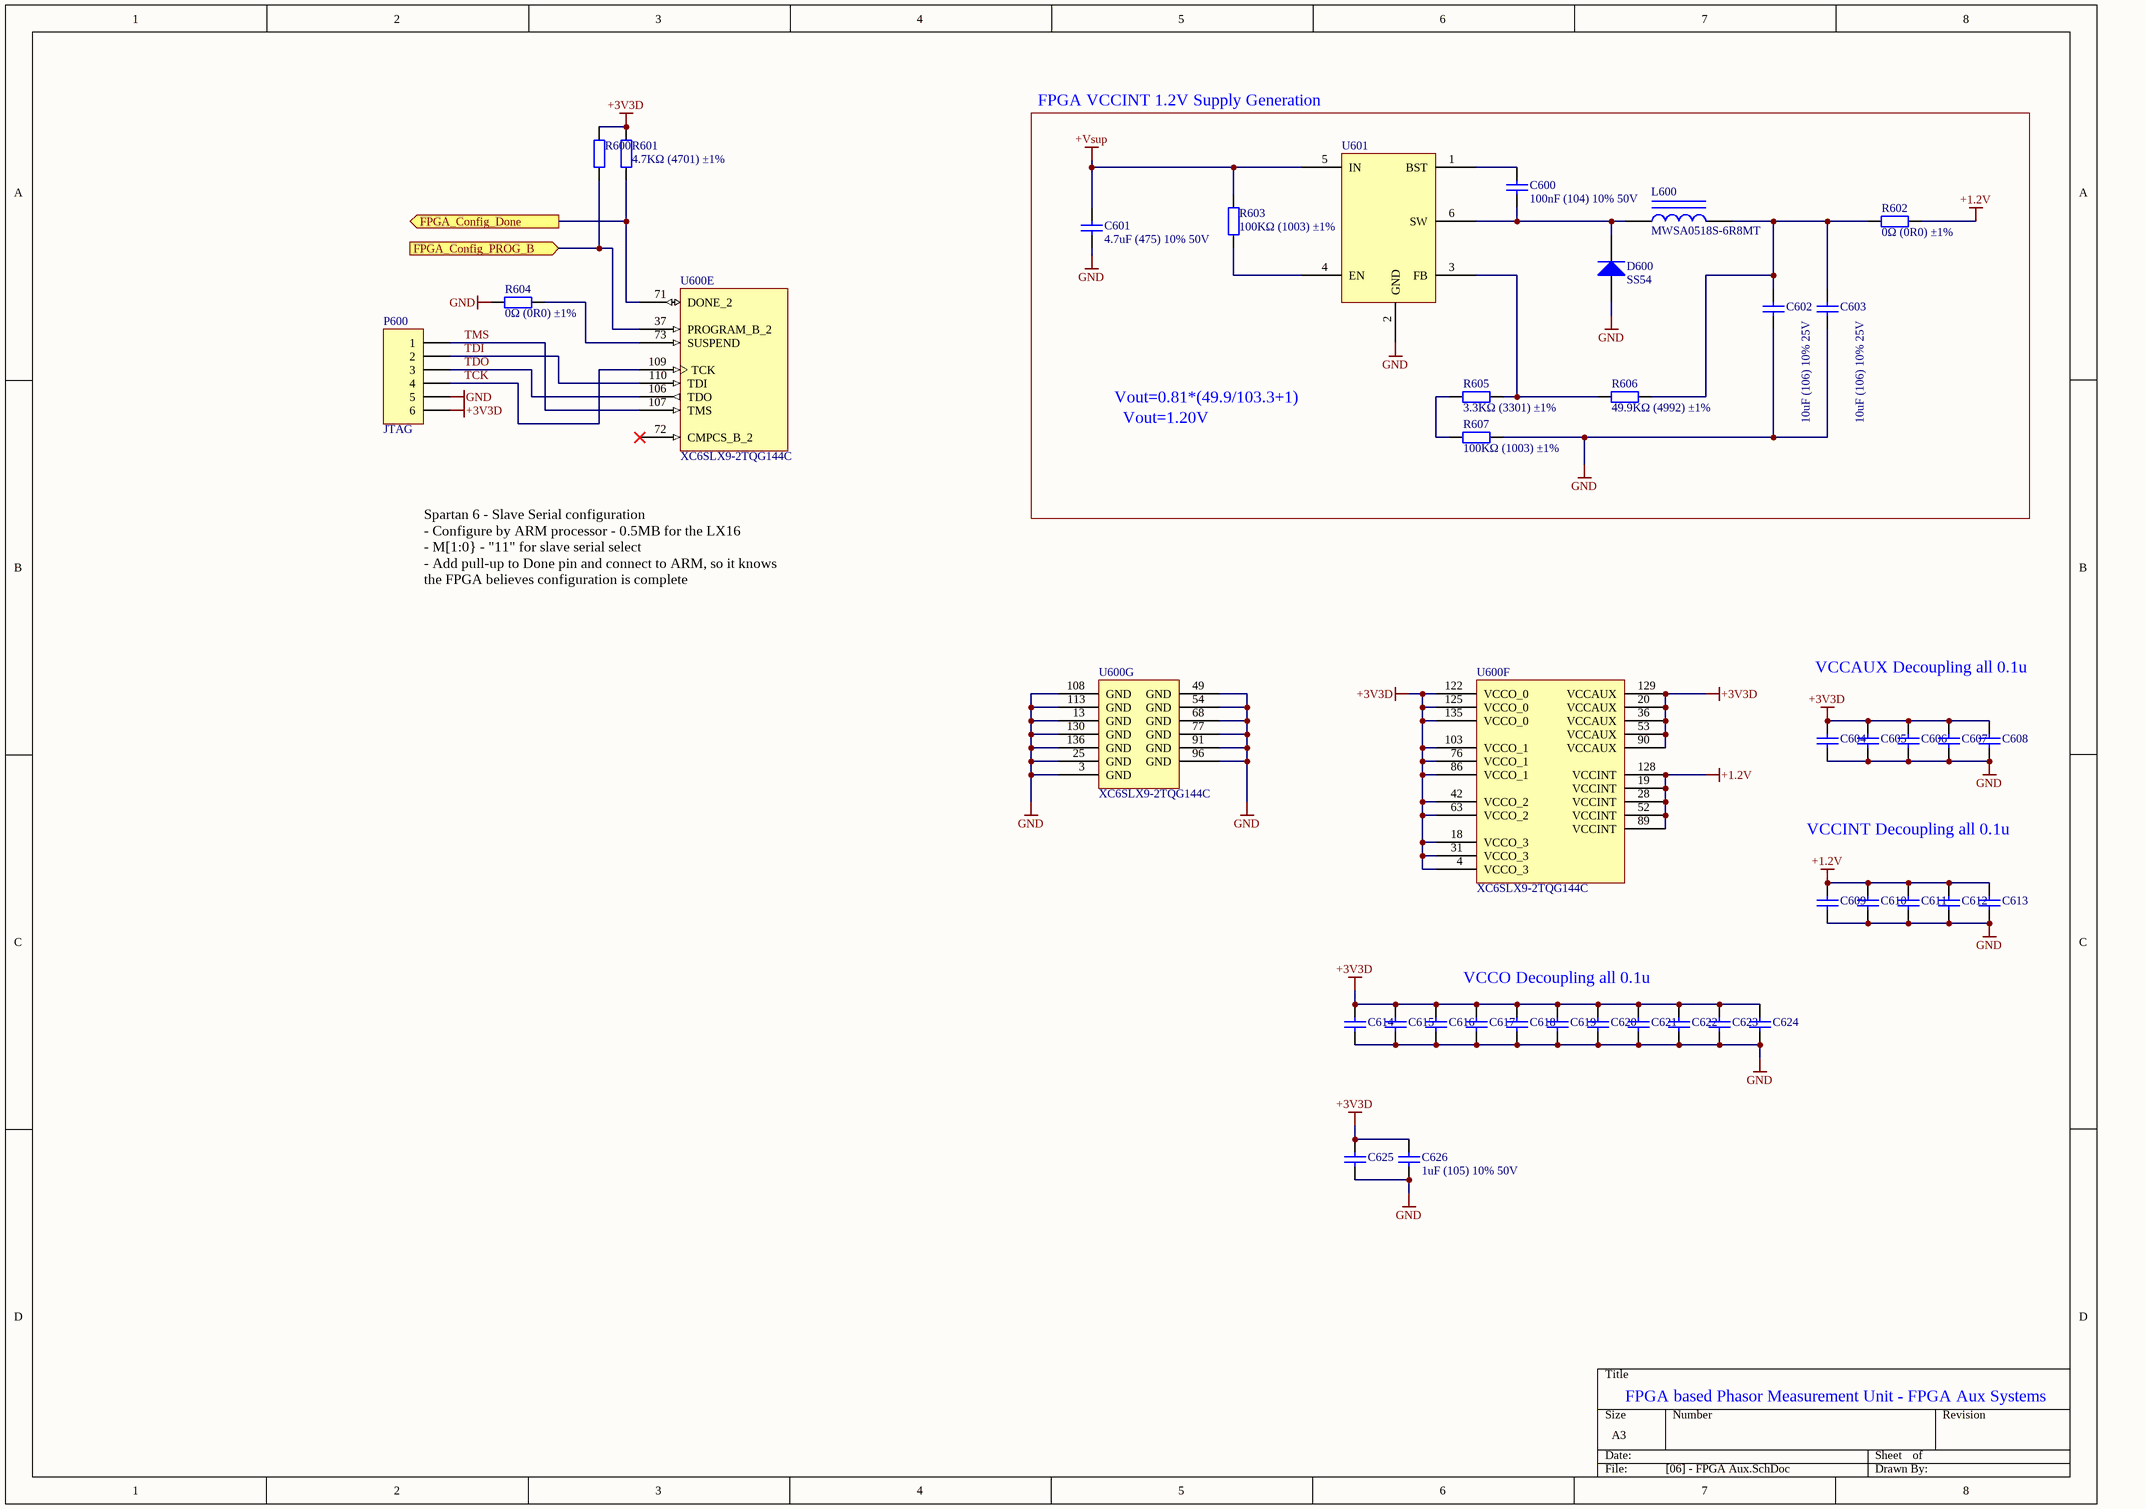
[diagram p5: [06] - FPGA Aux.SchDoc]

### Parts
C600  100nF (104) 10% 50V  [0603_C]
C601  4.7uF (475) 10% 50V  [1206_C]
C602  10uF (106) 10% 25V  [0805_C]
C603  10uF (106) 10% 25V  [0805_C]
C604  100nF (104) 10% 16V  [0402_C]  (value not drawn)
C605  100nF (104) 10% 16V  [0402_C]  (value not drawn)
C606  100nF (104) 10% 16V  [0402_C]  (value not drawn)
C607  100nF (104) 10% 16V  [0402_C]  (value not drawn)
C608  100nF (104) 10% 16V  [0402_C]  (value not drawn)
C609  100nF (104) 10% 16V  [0402_C]  (value not drawn)
C610  100nF (104) 10% 16V  [0402_C]  (value not drawn)
C611  100nF (104) 10% 16V  [0402_C]  (value not drawn)
C612  100nF (104) 10% 16V  [0402_C]  (value not drawn)
C613  100nF (104) 10% 16V  [0402_C]  (value not drawn)
C614  100nF (104) 10% 16V  [0402_C]  (value not drawn)
C615  100nF (104) 10% 16V  [0402_C]  (value not drawn)
C616  100nF (104) 10% 16V  [0402_C]  (value not drawn)
C617  100nF (104) 10% 16V  [0402_C]  (value not drawn)
C618  100nF (104) 10% 16V  [0402_C]  (value not drawn)
C619  100nF (104) 10% 16V  [0402_C]  (value not drawn)
C620  100nF (104) 10% 16V  [0402_C]  (value not drawn)
C621  100nF (104) 10% 16V  [0402_C]  (value not drawn)
C622  100nF (104) 10% 16V  [0402_C]  (value not drawn)
C623  100nF (104) 10% 16V  [0402_C]  (value not drawn)
C624  100nF (104) 10% 16V  [0402_C]  (value not drawn)
C625  1uF (105) 10% 50V  [0603_C]  (value not drawn)
C626  1uF (105) 10% 50V  [0603_C]
D600  SS54  [SMA(DO-214AC)_S1]
L600  MWSA0518S-6R8MT  [MWSA0518]
P600  JTAG  [HDR1X6]
R600  4.7KΩ (4701) ±1%  [0402_R]  (value not drawn)
R601  4.7KΩ (4701) ±1%  [0402_R]
R602  0Ω (0R0) ±1%  [0805_R]
R603  100KΩ (1003) ±1%  [0402_R]
R604  0Ω (0R0) ±1%  [0402_R]
R605  3.3KΩ (3301) ±1%  [0402_R]
R606  49.9KΩ (4992) ±1%  [0402_R]
R607  100KΩ (1003) ±1%  [0402_R]
U600  XC6SLX9-2TQG144C  [TQG144_N]  (parts E,F,G of 7)
U601  STEP-DOWN CONVERTER  [*TSOT-23_S6]  (value not drawn)

### Ports
FPGA_Config_Done (out), FPGA_Config_PROG_B (in)

### Nets
+1.2V: C609.2 C610.2 C611.2 C612.2 C613.2 R602.2 U600.19(VCCINT) U600.28(VCCINT) U600.52(VCCINT) U600.89(VCCINT) U600.128(VCCINT)
+3V3D: C604.2 C605.2 C606.2 C607.2 C608.2 C614.2 C615.2 C616.2 C617.2 C618.2 C619.2 C620.2 C621.2 C622.2 C623.2 C624.2 C625.2 C626.2 P600.6 R600.2 R601.2 U600.4(VCCO_3) U600.18(VCCO_3) U600.20(VCCAUX) U600.31(VCCO_3) U600.36(VCCAUX) U600.42(VCCO_2) U600.53(VCCAUX) U600.63(VCCO_2) U600.76(VCCO_1) U600.86(VCCO_1) U600.90(VCCAUX) U600.103(VCCO_1) U600.122(VCCO_0) U600.125(VCCO_0) U600.129(VCCAUX) U600.135(VCCO_0)
+Vsup: C601.2 R603.2 U601.5(IN)
GND: C601.1 C602.1 C603.1 C604.1 C605.1 C606.1 C607.1 C608.1 C609.1 C610.1 C611.1 C612.1 C613.1 C614.1 C615.1 C616.1 C617.1 C618.1 C619.1 C620.1 C621.1 C622.1 C623.1 C624.1 C625.1 C626.1 D600.1(A) P600.5 R604.1 R607.1 U600.3(GND) U600.13(GND) U600.25(GND) U600.49(GND) U600.54(GND) U600.68(GND) U600.77(GND) U600.91(GND) U600.96(GND) U600.108(GND) U600.113(GND) U600.130(GND) U600.136(GND) U601.2(GND)
TCK: P600.4 U600.109(TCK)
TDI: P600.2 U600.110(TDI)
TDO: P600.3 U600.106(TDO)
TMS: P600.1 U600.107(TMS)
NetC600_1: C600.1 D600.2(K) L600.1 U601.6(SW)
NetC600_2: C600.2 U601.1(BST)
NetC602_2: C602.2 C603.2 L600.2 R602.1 R606.2
NetR600_1: R600.1 U600.37(PROGRAM_B_2) ; port FPGA_Config_PROG_B
NetR601_1: R601.1 U600.71(DONE_2) ; port FPGA_Config_Done
NetR603_1: R603.1 U601.4(EN)
NetR604_2: R604.2 U600.73(SUSPEND)
NetR605_1: R605.1 R606.1 U601.3(FB)
NetR605_2: R605.2 R607.2

Not connected (* = marked no-connect by the designer): U600 72(CMPCS_B_2)*

### Notes on the sheet
- FPGA VCCINT 1.2V Supply Generation
- Vout=1.20V
- Vout=0.81*(49.9/103.3+1)
- Spartan 6 - Slave Serial configuration
  - Configure by ARM processor - 0.5MB for the LX16
  - M[1:0} - "11" for slave serial select
  - Add pull-up to Done pin and connect to ARM, so it knows the FPGA believes configuration is complete
- VCCAUX Decoupling all 0.1u
- VCCINT Decoupling all 0.1u
- VCCO Decoupling all 0.1u
- FPGA based Phasor Measurement Unit - FPGA Aux Systems

### Library data of the parts
C600 = 0603 100nF (104) 10% 50V: 贴片电容; ComponentLink1Description: 供应商链接; ComponentLink1URL: http://www.szlcsc.com/product/details_15331.html; Package: 0603; Supplier: LC; SuppliersPartNumber: C14663
C601 = 1206 4.7uF (475) 10% 50V: 贴片电容; ComponentLink1Description: 供应商链接; ComponentLink1URL: http://www.szlcsc.com/product/details_30577.html; Package: 1206; Supplier: LC; SuppliersPartNumber: C29823
C602 C603 = 0805 10uF (106) 10% 25V: 贴片电容; ComponentLink1Description: 供应商链接; ComponentLink1URL: http://www.szlcsc.com/product/details_16532.html; Package: 0805; Supplier: LC; SuppliersPartNumber: C15850
C604-C624 = 0402 100nF (104) 10% 16V: 贴片电容; ComponentLink1Description: 供应商链接; ComponentLink1URL: http://www.szlcsc.com/product/details_1877.html; Package: 0402; Supplier: LC; SuppliersPartNumber: C1525
C625 C626 = 0603 1uF (105) 10% 50V: 贴片电容; ComponentLink1Description: 供应商链接; ComponentLink1URL: http://www.szlcsc.com/product/details_16531.html; Package: 0603; Supplier: LC; SuppliersPartNumber: C15849
D600 = SMA(DO-214AC) SS54: 二极管; ComponentLink1Description: 供应商链接; ComponentLink1URL: http://www.szlcsc.com/product/details_23178.html; Package: SMA(DO-214AC); Supplier: LC; SuppliersPartNumber: C22452
L600 = MWSA0518S-6R8MT: POWER INDUCTORS SMD,5.2X5.4X1.8MM ROHS; Value: 6.8uH; Current Rating: 5.0A; Package: 5.2X5.4X1.8MM; Supplier: LC; SuppliersPartNumber: C408348
P600 = Header 6: Header, 6-Pin; LatestRevisionDate: 17-Jul-2002; LatestRevisionNote: Re-released for DXP Platform.; Publisher: Altium Limited; JLCPCB: NO
R600 R601 = 0402 4.7KΩ (4701) 1%: 贴片电阻; ComponentLink1Description: 供应商链接; ComponentLink1URL: http://www.szlcsc.com/product/details_26643.html; Package: 0402; Supplier: LC; SuppliersPartNumber: C25900
R602 = 0805 0Ω (0R0) 1%: 贴片电阻; ComponentLink1Description: 供应商链接; ComponentLink1URL: http://www.szlcsc.com/product/details_18165.html; Package: 0805; Supplier: LC; SuppliersPartNumber: C17477
R603 R607 = 0402 100KΩ (1003) 1%: 贴片电阻; ComponentLink1Description: 供应商链接; ComponentLink1URL: http://www.szlcsc.com/product/details_26484.html; Package: 0402; Supplier: LC; SuppliersPartNumber: C25741
R604 = 0402 0Ω (0R0) 1%: 贴片电阻; ComponentLink1Description: 供应商链接; ComponentLink1URL: http://www.szlcsc.com/product/details_17853.html; Package: 0402; Supplier: LC; SuppliersPartNumber: C17168
R605 = 0402 3.3KΩ (3301) 1%: 贴片电阻; ComponentLink1Description: 供应商链接; ComponentLink1URL: http://www.szlcsc.com/product/details_26633.html; Package: 0402; Supplier: LC; SuppliersPartNumber: C25890
R606 = 0402 49.9KΩ (4992) 1%: 贴片电阻; ComponentLink1Description: 供应商链接; ComponentLink1URL: http://www.szlcsc.com/product/details_26640.html; Package: 0402; Supplier: LC; SuppliersPartNumber: C25897
U600 = CMP-0067-00454-1: Spartan-6 LX 1.2V FPGA, 102 User I/Os, 144-Pin TQFP (0.5mm Pitch), Speed Grade 2, Commercial Grade, Pb-Free; PackageVersion: ver1.2, Jun-2004; DatasheetVersion: ver1.6, Nov-2010; PackageDescription: 144-Pin Thin Quad Flat Pack (TQG144) - Pb-Free; PackageReference: TQG144; Code_JEDEC: MS-026-BFB; SuppliersPartNumber: C27408
U601 = MP2359: 1.2A, 24V, 1.4MHz STEP-DOWN CONVERTER IN A TSOT23-6; SuppliersPartNumber: C14259

## Sheet [07] - FPGA IO.SchDoc
size A3
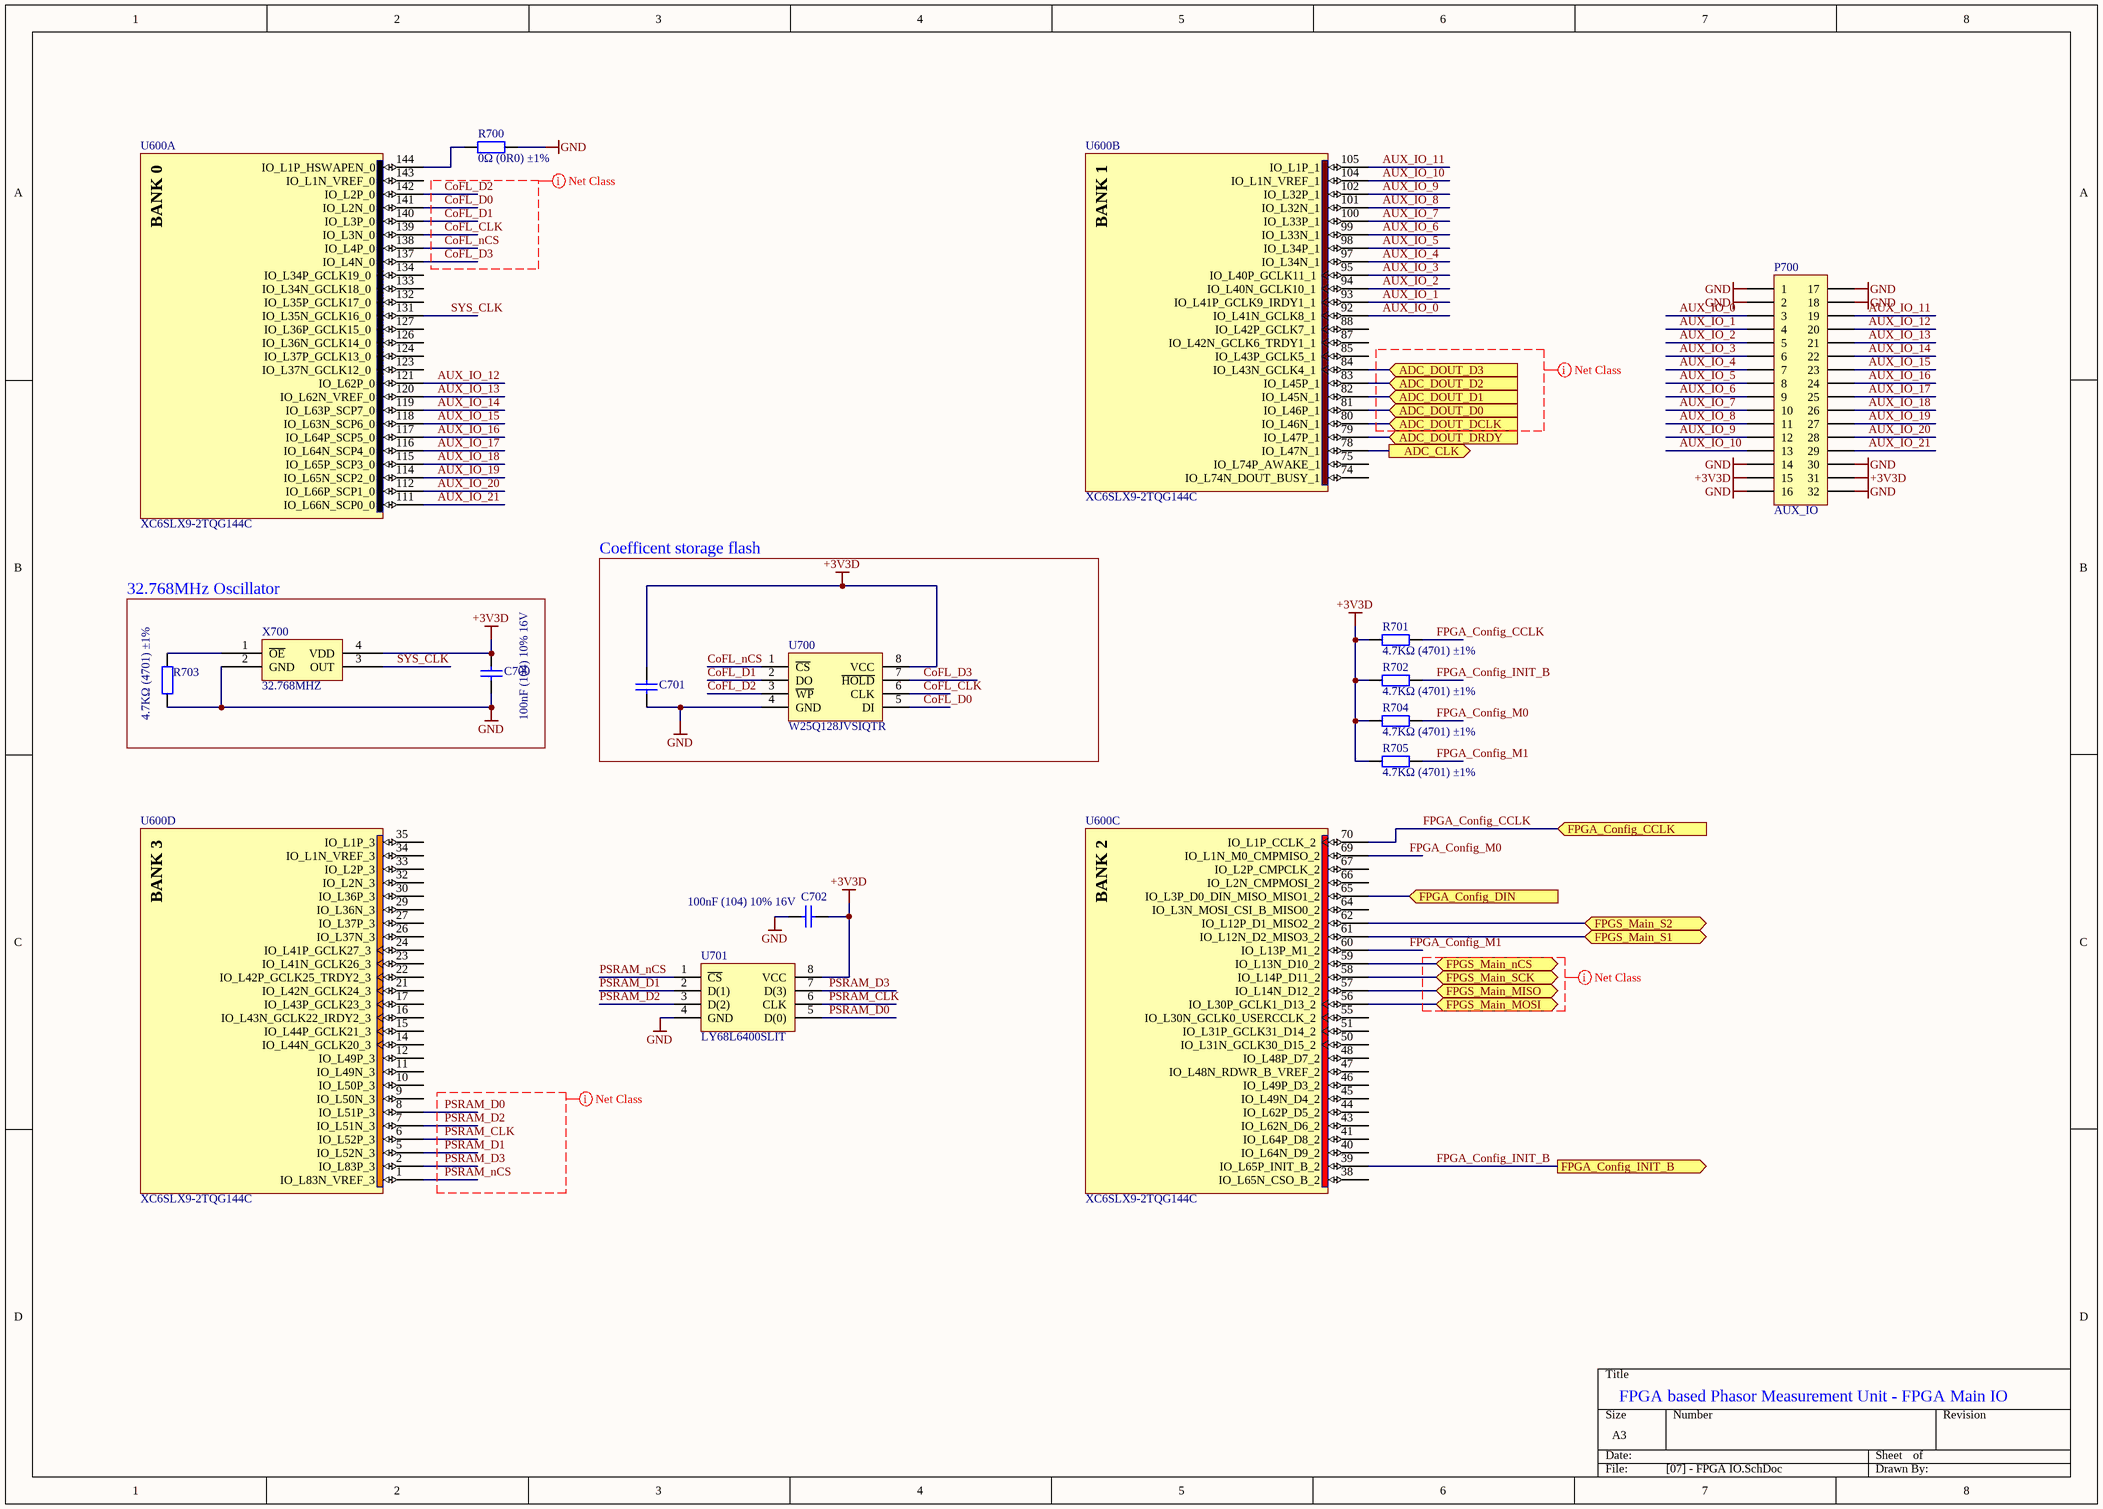
[diagram p6: [07] - FPGA IO.SchDoc]

### Parts
C700  100nF (104) 10% 16V  [0402_C]
C701  100nF (104) 10% 16V  [0402_C]  (value not drawn)
C702  100nF (104) 10% 16V  [0402_C]
P700  AUX_IO  [HDR2X16_CEN]
R700  0Ω (0R0) ±1%  [0402_R]
R701  4.7KΩ (4701) ±1%  [0402_R]
R702  4.7KΩ (4701) ±1%  [0402_R]
R703  4.7KΩ (4701) ±1%  [0402_R]
R704  4.7KΩ (4701) ±1%  [0402_R]
R705  4.7KΩ (4701) ±1%  [0402_R]
U600  XC6SLX9-2TQG144C  [TQG144_N]  (parts A,B,C,D of 7)
U700  W25Q128JVSIQTR  [SOIC-8_208mil]
U701  LY68L6400SLIT  [SOIC-8_208mil]
X700  32.768MHZ  [7050 Clock]

### Blocks framed on the sheet
Coefficent storage flash: C701 U700
32.768MHz Oscillator: C700 R703 X700

### Ports
ADC_CLK (out), ADC_DOUT_D0 (in), ADC_DOUT_D1 (in), ADC_DOUT_D2 (in), ADC_DOUT_D3 (in), ADC_DOUT_DCLK (in), ADC_DOUT_DRDY (in), FPGA_Config_CCLK (in), FPGA_Config_DIN (in), FPGA_Config_INIT_B (out), FPGS_Main_MISO (bidir), FPGS_Main_MOSI (bidir), FPGS_Main_nCS (bidir), FPGS_Main_S1 (bidir), FPGS_Main_S2 (bidir), FPGS_Main_SCK (bidir)

### Nets
+3V3D: C700.2 C701.2 C702.1 P700.15 P700.31 R701.2 R702.2 R704.2 R705.2 U700.8(VCC) U701.8(VCC) X700.4(VDD)
GND: C700.1 C701.1 C702.2 P700.1 P700.2 P700.14 P700.16 P700.17 P700.18 P700.30 P700.32 R700.2 R703.1 U700.4(GND) U701.4(GND) X700.2(GND)
AUX_IO_0: P700.3 U600.92(IO_L41N_GCLK8_1)
AUX_IO_1: P700.4 U600.93(IO_L41P_GCLK9_IRDY1_1)
AUX_IO_2: P700.5 U600.94(IO_L40N_GCLK10_1)
AUX_IO_3: P700.6 U600.95(IO_L40P_GCLK11_1)
AUX_IO_4: P700.7 U600.97(IO_L34N_1)
AUX_IO_5: P700.8 U600.98(IO_L34P_1)
AUX_IO_6: P700.9 U600.99(IO_L33N_1)
AUX_IO_7: P700.10 U600.100(IO_L33P_1)
AUX_IO_8: P700.11 U600.101(IO_L32N_1)
AUX_IO_9: P700.12 U600.102(IO_L32P_1)
AUX_IO_10: P700.13 U600.104(IO_L1N_VREF_1)
AUX_IO_11: P700.19 U600.105(IO_L1P_1)
AUX_IO_12: P700.20 U600.121(IO_L62P_0)
AUX_IO_13: P700.21 U600.120(IO_L62N_VREF_0)
AUX_IO_14: P700.22 U600.119(IO_L63P_SCP7_0)
AUX_IO_15: P700.23 U600.118(IO_L63N_SCP6_0)
AUX_IO_16: P700.24 U600.117(IO_L64P_SCP5_0)
AUX_IO_17: P700.25 U600.116(IO_L64N_SCP4_0)
AUX_IO_18: P700.26 U600.115(IO_L65P_SCP3_0)
AUX_IO_19: P700.27 U600.114(IO_L65N_SCP2_0)
AUX_IO_20: P700.28 U600.112(IO_L66P_SCP1_0)
AUX_IO_21: P700.29 U600.111(IO_L66N_SCP0_0)
CoFL_CLK: U600.139(IO_L3N_0) U700.6(CLK)
CoFL_D0: U600.141(IO_L2N_0) U700.5(DI)
CoFL_D1: U600.140(IO_L3P_0) U700.2(DO)
CoFL_D2: U600.142(IO_L2P_0) U700.3(~{WP})
CoFL_D3: U600.137(IO_L4N_0) U700.7(~{HOLD})
CoFL_nCS: U600.138(IO_L4P_0) U700.1(~{CS})
FPGA_Config_CCLK: R701.1 U600.70(IO_L1P_CCLK_2) ; port FPGA_Config_CCLK
FPGA_Config_INIT_B: R702.1 U600.39(IO_L65P_INIT_B_2) ; port FPGA_Config_INIT_B
FPGA_Config_M0: R704.1 U600.69(IO_L1N_M0_CMPMISO_2)
FPGA_Config_M1: R705.1 U600.60(IO_L13P_M1_2)
PSRAM_CLK: U600.6(IO_L52P_3) U701.6(CLK)
PSRAM_D0: U600.8(IO_L51P_3) U701.5(D(0))
PSRAM_D1: U600.5(IO_L52N_3) U701.2(D(1))
PSRAM_D2: U600.7(IO_L51N_3) U701.3(D(2))
PSRAM_D3: U600.2(IO_L83P_3) U701.7(D(3))
PSRAM_nCS: U600.1(IO_L83N_VREF_3) U701.1(~{CS})
SYS_CLK: U600.131(IO_L35N_GCLK16_0) X700.3(OUT)
NetR700_1: R700.1 U600.144(IO_L1P_HSWAPEN_0)
NetR703_2: R703.2 X700.1(~{OE})
NetU500_25: U600.84(IO_L43N_GCLK4_1) ; port ADC_DOUT_D3
NetU500_26: U600.83(IO_L45P_1) ; port ADC_DOUT_D2
NetU500_27: U600.82(IO_L45N_1) ; port ADC_DOUT_D1
NetU500_28: U600.81(IO_L46P_1) ; port ADC_DOUT_D0
NetU500_29: U600.80(IO_L46N_1) ; port ADC_DOUT_DCLK
NetU500_30: U600.79(IO_L47P_1) ; port ADC_DOUT_DRDY
NetU500_32: U600.78(IO_L47N_1) ; port ADC_CLK
NetU600_56: U600.56(IO_L30P_GCLK1_D13_2) ; port FPGS_Main_MOSI
NetU600_57: U600.57(IO_L14N_D12_2) ; port FPGS_Main_MISO
NetU600_58: U600.58(IO_L14P_D11_2) ; port FPGS_Main_SCK
NetU600_59: U600.59(IO_L13N_D10_2) ; port FPGS_Main_nCS
NetU600_61: U600.61(IO_L12N_D2_MISO3_2) ; port FPGS_Main_S1
NetU600_62: U600.62(IO_L12P_D1_MISO2_2) ; port FPGS_Main_S2
NetU600_65: U600.65(IO_L3P_D0_DIN_MISO_MISO1_2) ; port FPGA_Config_DIN

Not connected (* = marked no-connect by the designer): U600 9(IO_L50N_3) 10(IO_L50P_3) 11(IO_L49N_3) 12(IO_L49P_3) 14(IO_L44N_GCLK20_3) 15(IO_L44P_GCLK21_3) 16(IO_L43N_GCLK22_IRDY2_3) 17(IO_L43P_GCLK23_3) 21(IO_L42N_GCLK24_3) 22(IO_L42P_GCLK25_TRDY2_3) 23(IO_L41N_GCLK26_3) 24(IO_L41P_GCLK27_3) 26(IO_L37N_3) 27(IO_L37P_3) 29(IO_L36N_3) 30(IO_L36P_3) 32(IO_L2N_3) 33(IO_L2P_3) 34(IO_L1N_VREF_3) 35(IO_L1P_3) 38(IO_L65N_CSO_B_2) 40(IO_L64N_D9_2) 41(IO_L64P_D8_2) 43(IO_L62N_D6_2) 44(IO_L62P_D5_2) 45(IO_L49N_D4_2) 46(IO_L49P_D3_2) 47(IO_L48N_RDWR_B_VREF_2) 48(IO_L48P_D7_2) 50(IO_L31N_GCLK30_D15_2) 51(IO_L31P_GCLK31_D14_2) 55(IO_L30N_GCLK0_USERCCLK_2) 64(IO_L3N_MOSI_CSI_B_MISO0_2) 66(IO_L2N_CMPMOSI_2) 67(IO_L2P_CMPCLK_2) 74(IO_L74N_DOUT_BUSY_1) 75(IO_L74P_AWAKE_1) 85(IO_L43P_GCLK5_1) 87(IO_L42N_GCLK6_TRDY1_1) 88(IO_L42P_GCLK7_1) 123(IO_L37N_GCLK12_0) 124(IO_L37P_GCLK13_0) 126(IO_L36N_GCLK14_0) 127(IO_L36P_GCLK15_0) 132(IO_L35P_GCLK17_0) 133(IO_L34N_GCLK18_0) 134(IO_L34P_GCLK19_0) 143(IO_L1N_VREF_0)

### Layout directives
net class QSPI_FLASH: CoFL_CLK, CoFL_D0, CoFL_D1, CoFL_D2, CoFL_D3, CoFL_nCS
net class PSRAM: PSRAM_CLK, PSRAM_D0, PSRAM_D1, PSRAM_D2, PSRAM_D3, PSRAM_nCS
net class ADC_DOUT: (no net found under the mark)
net class FPGA_Main_SPI: (no net found under the mark)

### Notes on the sheet
- FPGA based Phasor Measurement Unit - FPGA Main IO
- (in symbol CMP-0067-00454-1, part A) BANK 0
- (in symbol CMP-0067-00454-1, part B) BANK 1
- (in symbol CMP-0067-00454-1, part C) BANK 2
- (in symbol CMP-0067-00454-1, part D) BANK 3

### Library data of the parts
C700-C702 = 0402 100nF (104) 10% 16V: 贴片电容; ComponentLink1Description: 供应商链接; ComponentLink1URL: http://www.szlcsc.com/product/details_1877.html; Package: 0402; Supplier: LC; SuppliersPartNumber: C1525
P700 = Header 16X2A: Header, 16-Pin, Dual row; LatestRevisionDate: 17-Jul-2002; LatestRevisionNote: Re-released for DXP Platform.; Publisher: Altium Limited; JLCPCB: NO
R700 = 0402 0Ω (0R0) 1%: 贴片电阻; ComponentLink1Description: 供应商链接; ComponentLink1URL: http://www.szlcsc.com/product/details_17853.html; Package: 0402; Supplier: LC; SuppliersPartNumber: C17168
R701-R705 = 0402 4.7KΩ (4701) 1%: 贴片电阻; ComponentLink1Description: 供应商链接; ComponentLink1URL: http://www.szlcsc.com/product/details_26643.html; Package: 0402; Supplier: LC; SuppliersPartNumber: C25900
U600 = CMP-0067-00454-1: as U600 on sheet [06] - FPGA Aux; PackageVersion: ver1.2, Jun-2004; DatasheetVersion: ver1.6, Nov-2010; PackageDescription: 144-Pin Thin Quad Flat Pack (TQG144) - Pb-Free; PackageReference: TQG144; Code_JEDEC: MS-026-BFB
U700 = W25Q128JVSIQTR_[C97521]: Flash ROM; ComponentLink1Description: 供应商链接; ComponentLink1URL: https://item.szlcsc.com/98729.html; Package: SOIC-8; Supplier: LC; SuppliersPartNumber: C97521
U701 = LY68L6400SLIT: Pseudo SRAM; ComponentLink1Description: 供应商链接; ComponentLink1URL: https://item.szlcsc.com/98729.html; Package: SOIC-8; Supplier: LC; SuppliersPartNumber: C261881
X700 = OCETDLJANF-32.768MHZ: SMD OSCILLATORS(XO) 32.768MHZ ±25PPM SMD-7050_4P ROHS; SuppliersPartNumber: C70525

## Sheet [08] - Microcontroller.SchDoc
size A3
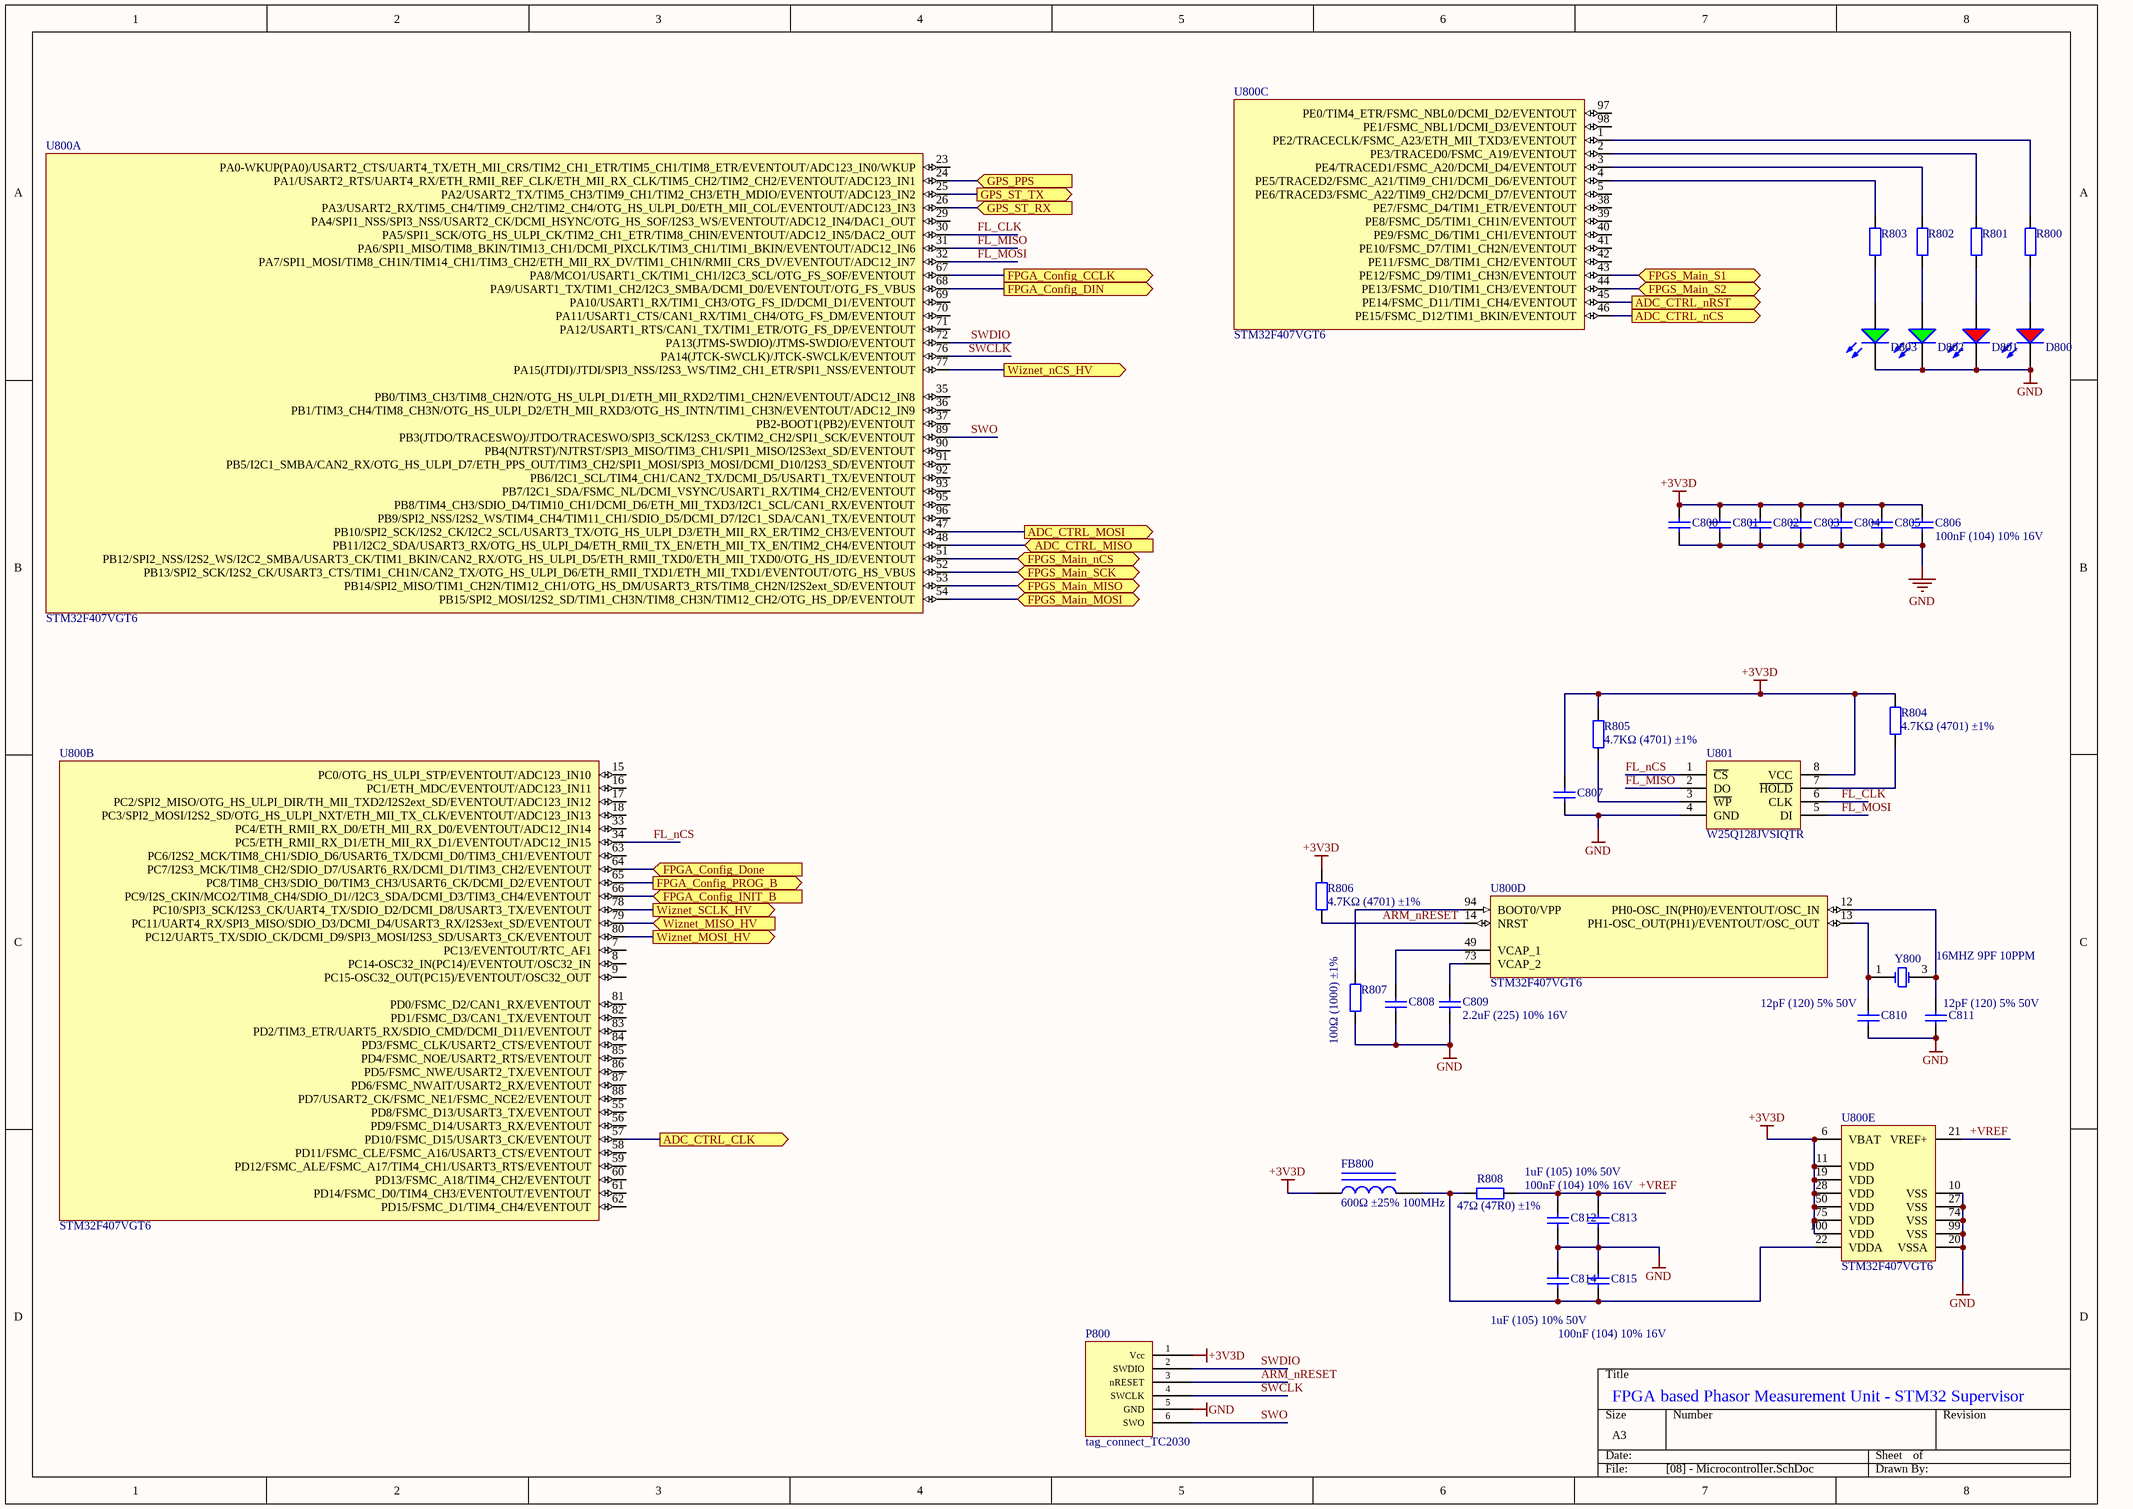
[diagram p7: [08] - Microcontroller.SchDoc]

### Parts
C800  100nF (104) 10% 16V  [0402_C]  (value not drawn)
C801  100nF (104) 10% 16V  [0402_C]  (value not drawn)
C802  100nF (104) 10% 16V  [0402_C]  (value not drawn)
C803  100nF (104) 10% 16V  [0402_C]  (value not drawn)
C804  100nF (104) 10% 16V  [0402_C]  (value not drawn)
C805  100nF (104) 10% 16V  [0402_C]  (value not drawn)
C806  100nF (104) 10% 16V  [0402_C]
C807  100nF (104) 10% 16V  [0402_C]  (value not drawn)
C808  2.2uF (225) 10% 16V  [0603_C]  (value not drawn)
C809  2.2uF (225) 10% 16V  [0603_C]
C810  12pF (120) 5% 50V  [0402_C]
C811  12pF (120) 5% 50V  [0402_C]
C812  1uF (105) 10% 50V  [0603_C]
C813  100nF (104) 10% 16V  [0402_C]
C814  1uF (105) 10% 50V  [0603_C]
C815  100nF (104) 10% 16V  [0402_C]
D800  红灯 0603  [0603_LED_S1]  (value not drawn)
D801  红灯 0603  [0603_LED_S1]  (value not drawn)
D802  绿灯 0603  [0603_LED_S1]  (value not drawn)
D803  绿灯 0603  [0603_LED_S1]  (value not drawn)
FB800  600Ω ±25% 100MHz  [0805_L]
P800  tag_connect_TC2030  [TC2030-MCP-NL]
R800  150Ω (1500) ±1%  [0402_R]  (value not drawn)
R801  150Ω (1500) ±1%  [0402_R]  (value not drawn)
R802  150Ω (1500) ±1%  [0402_R]  (value not drawn)
R803  150Ω (1500) ±1%  [0402_R]  (value not drawn)
R804  4.7KΩ (4701) ±1%  [0402_R]
R805  4.7KΩ (4701) ±1%  [0402_R]
R806  4.7KΩ (4701) ±1%  [0402_R]
R807  100Ω (1000) ±1%  [0402_R]
R808  47Ω (47R0) ±1%  [0402_R]
U800  STM32F407VGT6  [LQFP-100_14x14x05P]  (parts A,B,C,D,E of 5)
U801  W25Q128JVSIQTR  [SOIC-8_208mil]
Y800  16MHZ 9PF 10PPM  [SMD-3225_4P]

### Ports
ADC_CTRL_CLK (out), ADC_CTRL_MISO (in), ADC_CTRL_MOSI (out), ADC_CTRL_nCS (out), ADC_CTRL_nRST (out), FPGA_Config_CCLK (out), FPGA_Config_DIN (out), FPGA_Config_Done (in), FPGA_Config_INIT_B (in), FPGA_Config_PROG_B (out), FPGS_Main_MISO (bidir), FPGS_Main_MOSI (bidir), FPGS_Main_nCS (bidir), FPGS_Main_S1 (bidir), FPGS_Main_S2 (bidir), FPGS_Main_SCK (bidir), GPS_PPS (in), GPS_ST_RX (in), GPS_ST_TX (out), Wiznet_MISO_HV (in), Wiznet_MOSI_HV (out), Wiznet_nCS_HV (out), Wiznet_SCLK_HV (out)

### Nets
+3V3D: C800.2 C801.2 C802.2 C803.2 C804.2 C805.2 C806.2 C807.2 FB800.1 P800.1(Vcc) R804.2 R805.1 R806.2 U800.6(VBAT) U800.11(VDD) U800.19(VDD) U800.28(VDD) U800.50(VDD) U800.75(VDD) U800.100(VDD) U801.8(VCC)
GND: C800.1 C801.1 C802.1 C803.1 C804.1 C805.1 C806.1 C807.1 C808.1 C809.1 C810.2 C811.2 C812.1 C813.1 C814.2 C815.2 D800.K D801.K D802.K D803.K P800.5(GND) R807.1 U800.10(VSS) U800.20(VSSA) U800.27(VSS) U800.74(VSS) U800.99(VSS) U801.4(GND)
+VREF: C812.2 C813.2 R808.2 U800.21(VREF+)
ARM_nRESET: P800.3(nRESET) R806.1 U800.14(NRST)
FL_CLK: U800.30(PA5/SPI1_SCK/OTG_HS_ULPI_CK/TIM2_CH1_ETR/TIM8_CHIN/EVENTOUT/ADC12_IN5/DAC2_OUT) U801.6(CLK)
FL_MISO: U800.31(PA6/SPI1_MISO/TIM8_BKIN/TIM13_CH1/DCMI_PIXCLK/TIM3_CH1/TIM1_BKIN/EVENTOUT/ADC12_IN6) U801.2(DO)
FL_MOSI: U800.32(PA7/SPI1_MOSI/TIM8_CH1N/TIM14_CH1/TIM3_CH2/ETH_MII_RX_DV/TIM1_CH1N/RMII_CRS_DV/EVENTOUT/ADC12_IN7) U801.5(DI)
FL_nCS: U800.34(PC5/ETH_RMII_RX_D1/ETH_MII_RX_D1/EVENTOUT/ADC12_IN15) U801.1(~{CS})
FPGA_Config_CCLK: U800.67(PA8/MCO1/USART1_CK/TIM1_CH1/I2C3_SCL/OTG_FS_SOF/EVENTOUT) ; port FPGA_Config_CCLK
FPGA_Config_INIT_B: U800.66(PC9/I2S_CKIN/MCO2/TIM8_CH4/SDIO_D1//I2C3_SDA/DCMI_D3/TIM3_CH4/EVENTOUT) ; port FPGA_Config_INIT_B
SWCLK: P800.4(SWCLK) U800.76(PA14(JTCK-SWCLK)/JTCK-SWCLK/EVENTOUT)
SWDIO: P800.2(SWDIO) U800.72(PA13(JTMS-SWDIO)/JTMS-SWDIO/EVENTOUT)
SWO: P800.6(SWO) U800.89(PB3(JTDO/TRACESWO)/JTDO/TRACESWO/SPI3_SCK/I2S3_CK/TIM2_CH2/SPI1_SCK/EVENTOUT)
NetC808_2: C808.2 U800.49(VCAP_1)
NetC809_2: C809.2 U800.73(VCAP_2)
NetC810_1: C810.1 U800.13(PH1-OSC_OUT(PH1)/EVENTOUT/OSC_OUT) Y800.1(OSC1)
NetC811_1: C811.1 U800.12(PH0-OSC_IN(PH0)/EVENTOUT/OSC_IN) Y800.3(OSC2)
NetC814_1: C814.1 C815.1 FB800.2 R808.1 U800.22(VDDA)
NetD800_A: D800.A R800.1
NetD801_A: D801.A R801.1
NetD802_A: D802.A R802.1
NetD803_A: D803.A R803.1
NetR600_1: U800.65(PC8/TIM8_CH3/SDIO_D0/TIM3_CH3/USART6_CK/DCMI_D2/EVENTOUT) ; port FPGA_Config_PROG_B
NetR601_1: U800.64(PC7/I2S3_MCK/TIM8_CH2/SDIO_D7/USART6_RX/DCMI_D1/TIM3_CH2/EVENTOUT) ; port FPGA_Config_Done
NetR800_2: R800.2 U800.1(PE2/TRACECLK/FSMC_A23/ETH_MII_TXD3/EVENTOUT)
NetR801_2: R801.2 U800.2(PE3/TRACED0/FSMC_A19/EVENTOUT)
NetR802_2: R802.2 U800.3(PE4/TRACED1/FSMC_A20/DCMI_D4/EVENTOUT)
NetR803_2: R803.2 U800.4(PE5/TRACED2/FSMC_A21/TIM9_CH1/DCMI_D6/EVENTOUT)
NetR804_1: R804.1 U801.7(~{HOLD})
NetR805_2: R805.2 U801.3(~{WP})
NetR807_2: R807.2 U800.94(BOOT0/VPP)
NetU100_3: U800.25(PA2/USART2_TX/TIM5_CH3/TIM9_CH1/TIM2_CH3/ETH_MDIO/EVENTOUT/ADC123_IN2) ; port GPS_ST_TX
NetU100_4: U800.77(PA15(JTDI)/JTDI/SPI3_NSS/I2S3_WS/TIM2_CH1_ETR/SPI1_NSS/EVENTOUT) ; port Wiznet_nCS_HV
NetU100_5: U800.78(PC10/SPI3_SCK/I2S3_CK/UART4_TX/SDIO_D2/DCMI_D8/USART3_TX/EVENTOUT) ; port Wiznet_SCLK_HV
NetU100_6: U800.80(PC12/UART5_TX/SDIO_CK/DCMI_D9/SPI3_MOSI/I2S3_SD/USART3_CK/EVENTOUT) ; port Wiznet_MOSI_HV
NetU101_12: U800.24(PA1/USART2_RTS/UART4_RX/ETH_RMII_REF_CLK/ETH_MII_RX_CLK/TIM5_CH2/TIM2_CH2/EVENTOUT/ADC123_IN1) ; port GPS_PPS
NetU101_13: U800.26(PA3/USART2_RX/TIM5_CH4/TIM9_CH2/TIM2_CH4/OTG_HS_ULPI_D0/ETH_MII_COL/EVENTOUT/ADC123_IN3) ; port GPS_ST_RX
NetU101_14: U800.79(PC11/UART4_RX/SPI3_MISO/SDIO_D3/DCMI_D4/USART3_RX/I2S3ext_SD/EVENTOUT) ; port Wiznet_MISO_HV
NetU500_18: U800.46(PE15/FSMC_D12/TIM1_BKIN/EVENTOUT) ; port ADC_CTRL_nCS
NetU500_19: U800.57(PD10/FSMC_D15/USART3_CK/EVENTOUT) ; port ADC_CTRL_CLK
NetU500_20: U800.47(PB10/SPI2_SCK/I2S2_CK/I2C2_SCL/USART3_TX/OTG_HS_ULPI_D3/ETH_MII_RX_ER/TIM2_CH3/EVENTOUT) ; port ADC_CTRL_MOSI
NetU500_21: U800.48(PB11/I2C2_SDA/USART3_RX/OTG_HS_ULPI_D4/ETH_RMII_TX_EN/ETH_MII_TX_EN/TIM2_CH4/EVENTOUT) ; port ADC_CTRL_MISO
NetU500_36: U800.45(PE14/FSMC_D11/TIM1_CH4/EVENTOUT) ; port ADC_CTRL_nRST
NetU600_56: U800.54(PB15/SPI2_MOSI/I2S2_SD/TIM1_CH3N/TIM8_CH3N/TIM12_CH2/OTG_HS_DP/EVENTOUT) ; port FPGS_Main_MOSI
NetU600_57: U800.53(PB14/SPI2_MISO/TIM1_CH2N/TIM12_CH1/OTG_HS_DM/USART3_RTS/TIM8_CH2N/I2S2ext_SD/EVENTOUT) ; port FPGS_Main_MISO
NetU600_58: U800.52(PB13/SPI2_SCK/I2S2_CK/USART3_CTS/TIM1_CH1N/CAN2_TX/OTG_HS_ULPI_D6/ETH_RMII_TXD1/ETH_MII_TXD1/EVENTOUT/OTG_HS_VBUS) ; port FPGS_Main_SCK
NetU600_59: U800.51(PB12/SPI2_NSS/I2S2_WS/I2C2_SMBA/USART3_CK/TIM1_BKIN/CAN2_RX/OTG_HS_ULPI_D5/ETH_RMII_TXD0/ETH_MII_TXD0/OTG_HS_ID/EVENTOUT) ; port FPGS_Main_nCS
NetU600_61: U800.43(PE12/FSMC_D9/TIM1_CH3N/EVENTOUT) ; port FPGS_Main_S1
NetU600_62: U800.44(PE13/FSMC_D10/TIM1_CH3/EVENTOUT) ; port FPGS_Main_S2
NetU600_65: U800.68(PA9/USART1_TX/TIM1_CH2/I2C3_SMBA/DCMI_D0/EVENTOUT/OTG_FS_VBUS) ; port FPGA_Config_DIN

Not connected (* = marked no-connect by the designer): U800 5(PE6/TRACED3/FSMC_A22/TIM9_CH2/DCMI_D7/EVENTOUT) 7(PC13/EVENTOUT/RTC_AF1) 8(PC14-OSC32_IN(PC14)/EVENTOUT/OSC32_IN) 9(PC15-OSC32_OUT(PC15)/EVENTOUT/OSC32_OUT) 15(PC0/OTG_HS_ULPI_STP/EVENTOUT/ADC123_IN10) 16(PC1/ETH_MDC/EVENTOUT/ADC123_IN11) 17(PC2/SPI2_MISO/OTG_HS_ULPI_DIR/TH_MII_TXD2/I2S2ext_SD/EVENTOUT/ADC123_IN12) 18(PC3/SPI2_MOSI/I2S2_SD/OTG_HS_ULPI_NXT/ETH_MII_TX_CLK/EVENTOUT/ADC123_IN13) 23(PA0-WKUP(PA0)/USART2_CTS/UART4_TX/ETH_MII_CRS/TIM2_CH1_ETR/TIM5_CH1/TIM8_ETR/EVENTOUT/ADC123_IN0/WKUP) 29(PA4/SPI1_NSS/SPI3_NSS/USART2_CK/DCMI_HSYNC/OTG_HS_SOF/I2S3_WS/EVENTOUT/ADC12_IN4/DAC1_OUT) 33(PC4/ETH_RMII_RX_D0/ETH_MII_RX_D0/EVENTOUT/ADC12_IN14) 35(PB0/TIM3_CH3/TIM8_CH2N/OTG_HS_ULPI_D1/ETH_MII_RXD2/TIM1_CH2N/EVENTOUT/ADC12_IN8) 36(PB1/TIM3_CH4/TIM8_CH3N/OTG_HS_ULPI_D2/ETH_MII_RXD3/OTG_HS_INTN/TIM1_CH3N/EVENTOUT/ADC12_IN9) 37(PB2-BOOT1(PB2)/EVENTOUT) 38(PE7/FSMC_D4/TIM1_ETR/EVENTOUT) 39(PE8/FSMC_D5/TIM1_CH1N/EVENTOUT) 40(PE9/FSMC_D6/TIM1_CH1/EVENTOUT) 41(PE10/FSMC_D7/TIM1_CH2N/EVENTOUT) 42(PE11/FSMC_D8/TIM1_CH2/EVENTOUT) 55(PD8/FSMC_D13/USART3_TX/EVENTOUT) 56(PD9/FSMC_D14/USART3_RX/EVENTOUT) 58(PD11/FSMC_CLE/FSMC_A16/USART3_CTS/EVENTOUT) 59(PD12/FSMC_ALE/FSMC_A17/TIM4_CH1/USART3_RTS/EVENTOUT) 60(PD13/FSMC_A18/TIM4_CH2/EVENTOUT) 61(PD14/FSMC_D0/TIM4_CH3/EVENTOUT/EVENTOUT) 62(PD15/FSMC_D1/TIM4_CH4/EVENTOUT) 63(PC6/I2S2_MCK/TIM8_CH1/SDIO_D6/USART6_TX/DCMI_D0/TIM3_CH1/EVENTOUT) 69(PA10/USART1_RX/TIM1_CH3/OTG_FS_ID/DCMI_D1/EVENTOUT) 70(PA11/USART1_CTS/CAN1_RX/TIM1_CH4/OTG_FS_DM/EVENTOUT) 71(PA12/USART1_RTS/CAN1_TX/TIM1_ETR/OTG_FS_DP/EVENTOUT) 81(PD0/FSMC_D2/CAN1_RX/EVENTOUT) 82(PD1/FSMC_D3/CAN1_TX/EVENTOUT) 83(PD2/TIM3_ETR/UART5_RX/SDIO_CMD/DCMI_D11/EVENTOUT) 84(PD3/FSMC_CLK/USART2_CTS/EVENTOUT) 85(PD4/FSMC_NOE/USART2_RTS/EVENTOUT) 86(PD5/FSMC_NWE/USART2_TX/EVENTOUT) 87(PD6/FSMC_NWAIT/USART2_RX/EVENTOUT) 88(PD7/USART2_CK/FSMC_NE1/FSMC_NCE2/EVENTOUT) 90(PB4(NJTRST)/NJTRST/SPI3_MISO/TIM3_CH1/SPI1_MISO/I2S3ext_SD/EVENTOUT) 91(PB5/I2C1_SMBA/CAN2_RX/OTG_HS_ULPI_D7/ETH_PPS_OUT/TIM3_CH2/SPI1_MOSI/SPI3_MOSI/DCMI_D10/I2S3_SD/EVENTOUT) 92(PB6/I2C1_SCL/TIM4_CH1/CAN2_TX/DCMI_D5/USART1_TX/EVENTOUT) 93(PB7/I2C1_SDA/FSMC_NL/DCMI_VSYNC/USART1_RX/TIM4_CH2/EVENTOUT) 95(PB8/TIM4_CH3/SDIO_D4/TIM10_CH1/DCMI_D6/ETH_MII_TXD3/I2C1_SCL/CAN1_RX/EVENTOUT) 96(PB9/SPI2_NSS/I2S2_WS/TIM4_CH4/TIM11_CH1/SDIO_D5/DCMI_D7/I2C1_SDA/CAN1_TX/EVENTOUT) 97(PE0/TIM4_ETR/FSMC_NBL0/DCMI_D2/EVENTOUT) 98(PE1/FSMC_NBL1/DCMI_D3/EVENTOUT)

### Notes on the sheet
- FPGA based Phasor Measurement Unit - STM32 Supervisor

### Library data of the parts
C800-C807 C813 C815 = 0402 100nF (104) 10% 16V: 贴片电容; ComponentLink1Description: 供应商链接; ComponentLink1URL: http://www.szlcsc.com/product/details_1877.html; Package: 0402; Supplier: LC; SuppliersPartNumber: C1525
C808 C809 = 0603 2.2uF (225) 10% 16V: 贴片电容; ComponentLink1Description: 供应商链接; ComponentLink1URL: http://www.szlcsc.com/product/details_24366.html; Package: 0603; Supplier: LC; SuppliersPartNumber: C23630
C810 C811 = 0402 12pF (120) 5% 50V: 贴片电容; ComponentLink1Description: 供应商链接; ComponentLink1URL: http://www.szlcsc.com/product/details_1899.html; Package: 0402; Supplier: LC; SuppliersPartNumber: C1547
C812 C814 = 0603 1uF (105) 10% 50V: 贴片电容; ComponentLink1Description: 供应商链接; ComponentLink1URL: http://www.szlcsc.com/product/details_16531.html; Package: 0603; Supplier: LC; SuppliersPartNumber: C15849
D800 D801 = 0603 红灯: 发光二极管; ComponentLink1Description: 供应商链接; ComponentLink1URL: http://www.szlcsc.com/product/details_2659.html; Package: 0603; Supplier: LC; SuppliersPartNumber: C2286
D802 D803 = 0603 绿灯: 发光二极管; ComponentLink1Description: 供应商链接; ComponentLink1URL: http://www.szlcsc.com/product/details_73152.html; Package: 0603; Supplier: LC; SuppliersPartNumber: C72043
FB800 = 0805 600Ω 25% 100MHz: 贴片磁珠; ComponentLink1Description: 供应商链接; ComponentLink1URL: http://www.szlcsc.com/product/details_1369.html; Package: 0805; Supplier: LC; SuppliersPartNumber: C1017
R800-R803 = 0402 150Ω (1500) 1%: 贴片电阻; ComponentLink1Description: 供应商链接; ComponentLink1URL: http://www.szlcsc.com/product/details_25825.html; Package: 0402; Supplier: LC; SuppliersPartNumber: C25082
R804-R806 = 0402 4.7KΩ (4701) 1%: 贴片电阻; ComponentLink1Description: 供应商链接; ComponentLink1URL: http://www.szlcsc.com/product/details_26643.html; Package: 0402; Supplier: LC; SuppliersPartNumber: C25900
R807 = 0402 100Ω (1000) 1%: 贴片电阻; ComponentLink1Description: 供应商链接; ComponentLink1URL: http://www.szlcsc.com/product/details_25819.html; Package: 0402; Supplier: LC; SuppliersPartNumber: C25076
R808 = 0402 47Ω (47R0) 1%: 贴片电阻; ComponentLink1Description: 供应商链接; ComponentLink1URL: http://www.szlcsc.com/product/details_25861.html; Package: 0402; Supplier: LC; SuppliersPartNumber: C25118
U800 = STM32F407VGT6: ARM; ComponentLink1Description: 供应商链接; ComponentLink1URL: http://www.szlcsc.com/product/details_12968.html; Package: LQFP-100_14x14x05P; Supplier: LC; SuppliersPartNumber: C12345
U801 = W25Q128JVSIQTR_[C97521]: Flash ROM; ComponentLink1Description: 供应商链接; ComponentLink1URL: https://item.szlcsc.com/98729.html; Package: SOIC-8; Supplier: LC; SuppliersPartNumber: C97521
Y800 = SMD-3225_4P  16MHZ 9PF 10PPM: 贴片晶振; ComponentLink1Description: 供应商链接; ComponentLink1URL: http://www.szlcsc.com/product/details_14393.html; Package: SMD-3225_4P; Supplier: LC; SuppliersPartNumber: C13738
P800 = tag_connect_TC2030: JLCPCB: NO

## Sheet [09] - Ethernet.SchDoc
size A3
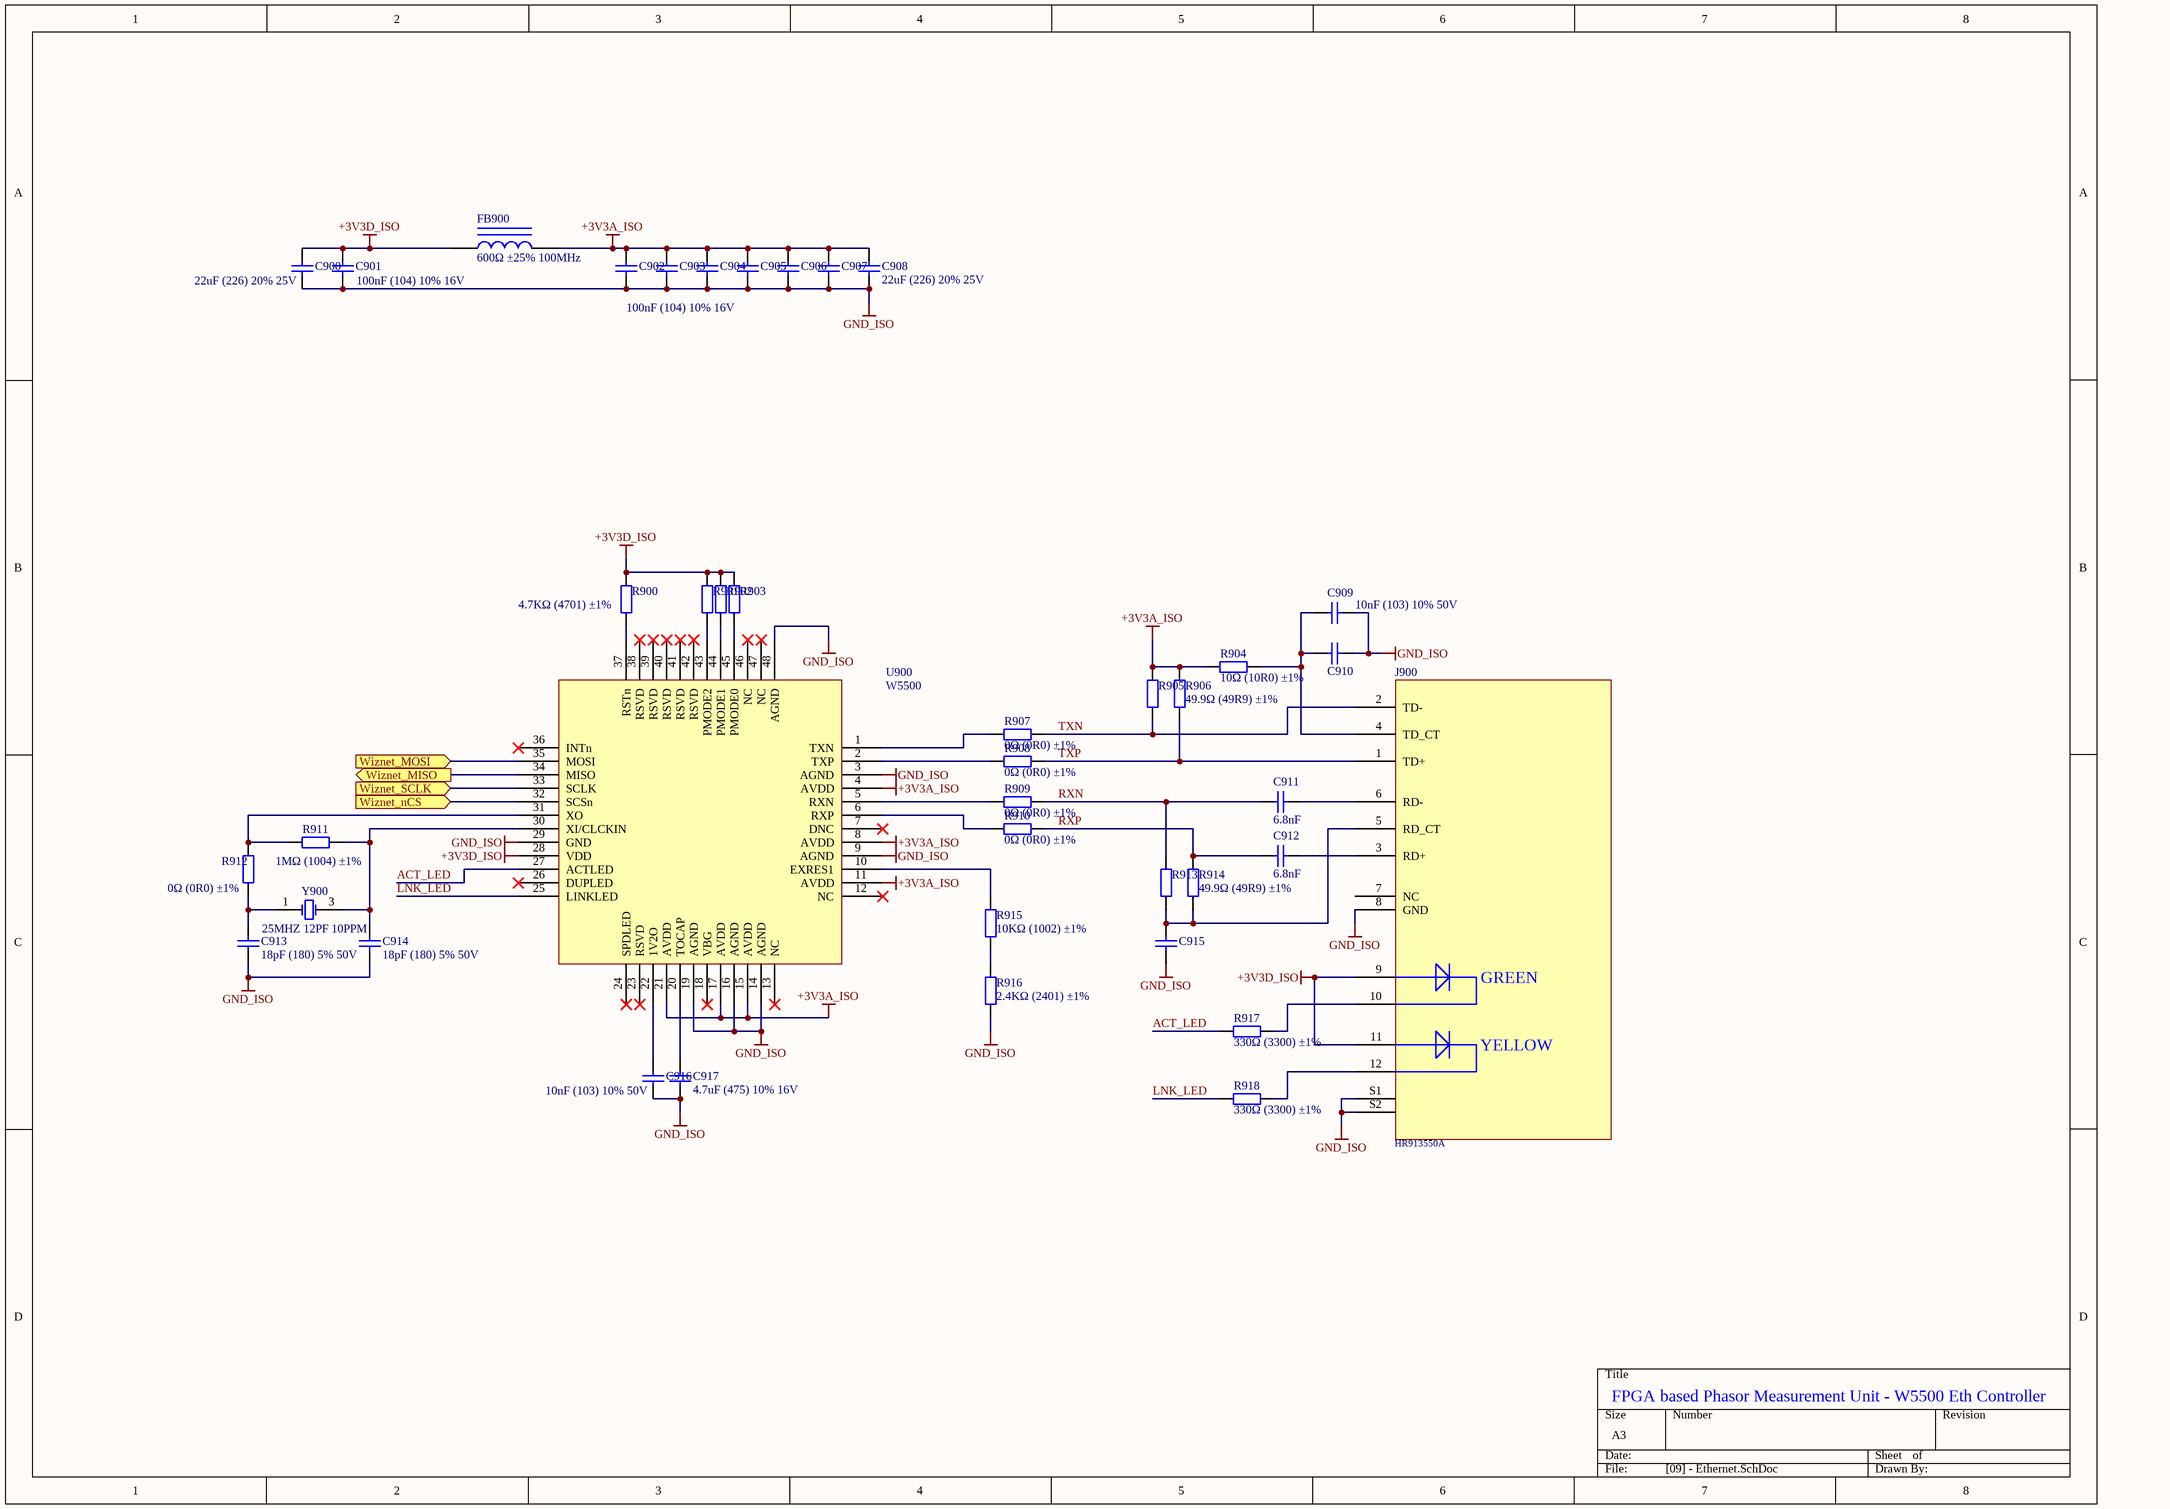
[diagram p8: [09] - Ethernet.SchDoc]

### Parts
C900  22uF (226) 20% 25V  [0805_C]
C901  100nF (104) 10% 16V  [0402_C]
C902  100nF (104) 10% 16V  [0402_C]
C903  100nF (104) 10% 16V  [0402_C]  (value not drawn)
C904  100nF (104) 10% 16V  [0402_C]  (value not drawn)
C905  100nF (104) 10% 16V  [0402_C]  (value not drawn)
C906  100nF (104) 10% 16V  [0402_C]  (value not drawn)
C907  100nF (104) 10% 16V  [0402_C]  (value not drawn)
C908  22uF (226) 20% 25V  [0805_C]
C909  10nF (103) 10% 50V  [0402_C]
C910  10nF (103) 10% 50V  [0402_C]  (value not drawn)
C911  6.8nF  [0402_C]
C912  6.8nF  [0402_C]
C913  18pF (180) 5% 50V  [0402_C]
C914  18pF (180) 5% 50V  [0402_C]
C915  10nF (103) 10% 50V  [0402_C]  (value not drawn)
C916  10nF (103) 10% 50V  [0402_C]
C917  4.7uF (475) 10% 16V  [0603_C]
FB900  600Ω ±25% 100MHz  [0805_L]
J900  HR913550A  [RJ45 MagJack]
R900  4.7KΩ (4701) ±1%  [0402_R]
R901  4.7KΩ (4701) ±1%  [0402_R]  (value not drawn)
R902  4.7KΩ (4701) ±1%  [0402_R]  (value not drawn)
R903  4.7KΩ (4701) ±1%  [0402_R]  (value not drawn)
R904  10Ω (10R0) ±1%  [0402_R]
R905  49.9Ω (49R9) ±1%  [0402_R]  (value not drawn)
R906  49.9Ω (49R9) ±1%  [0402_R]
R907  0Ω (0R0) ±1%  [0402_R]
R908  0Ω (0R0) ±1%  [0402_R]
R909  0Ω (0R0) ±1%  [0402_R]
R910  0Ω (0R0) ±1%  [0402_R]
R911  1MΩ (1004) ±1%  [0402_R]
R912  0Ω (0R0) ±1%  [0402_R]
R913  49.9Ω (49R9) ±1%  [0402_R]  (value not drawn)
R914  49.9Ω (49R9) ±1%  [0402_R]
R915  10KΩ (1002) ±1%  [0402_R]
R916  2.4KΩ (2401) ±1%  [0402_R]
R917  330Ω (3300) ±1%  [0603_R]
R918  330Ω (3300) ±1%  [0603_R]
U900  W5500  [LQFP-48_7x7x05P]
Y900  25MHZ 12PF 10PPM  [SMD-3225_4P]

### Ports
Wiznet_MISO (out), Wiznet_MOSI (in), Wiznet_nCS (in), Wiznet_SCLK (in)

### Nets
+3V3A_ISO: C902.2 C903.2 C904.2 C905.2 C906.2 C907.2 C908.2 FB900.2 R904.1 R905.2 R906.2 U900.4(AVDD) U900.8(AVDD) U900.11(AVDD) U900.15(AVDD) U900.17(AVDD) U900.21(AVDD)
+3V3D_ISO: C900.2 C901.2 FB900.1 J900.9 J900.11 R900.1 R901.2 R902.2 R903.2 U900.28(VDD)
GND_ISO: C900.1 C901.1 C902.1 C903.1 C904.1 C905.1 C906.1 C907.1 C908.1 C909.1 C910.1 C913.1 C914.1 C915.1 C916.1 C917.1 J900.8(GND) J900.S1 J900.S2 R916.1 U900.3(AGND) U900.9(AGND) U900.14(AGND) U900.16(AGND) U900.19(AGND) U900.29(GND) U900.48(AGND)
ACT_LED: R917.1 U900.27(ACTLED)
LNK_LED: R918.1 U900.25(LINKLED)
RXN: C911.1 R909.2 R913.2
RXP: C912.1 R910.2 R914.2
TXN: J900.2(TD-) R905.1 R907.2
TXP: J900.1(TD+) R906.1 R908.2
NetC909_2: C909.2 C910.2 J900.4(TD_CT) R904.2
NetC911_2: C911.2 J900.6(RD-)
NetC912_2: C912.2 J900.3(RD+)
NetC913_2: C913.2 R912.1 Y900.1(OSC1)
NetC914_2: C914.2 R911.2 U900.30(XI/CLCKIN) Y900.3(OSC2)
NetC915_2: C915.2 J900.5(RD_CT) R913.1 R914.1
NetC916_2: C916.2 U900.22(1V2O)
NetC917_2: C917.2 U900.20(TOCAP)
NetJ900_10: J900.10 R917.2
NetJ900_12: J900.12 R918.2
NetR900_2: R900.2 U900.37(RSTn)
NetR901_1: R901.1 U900.43(PMODE2)
NetR902_1: R902.1 U900.44(PMODE1)
NetR903_1: R903.1 U900.45(PMODE0)
NetR907_1: R907.1 U900.1(TXN)
NetR908_1: R908.1 U900.2(TXP)
NetR909_1: R909.1 U900.5(RXN)
NetR910_1: R910.1 U900.6(RXP)
NetR911_1: R911.1 R912.2 U900.31(XO)
NetR915_1: R915.1 R916.2
NetR915_2: R915.2 U900.10(EXRES1)
NetU100_11: U900.35(MOSI) ; port Wiznet_MOSI
NetU100_12: U900.33(SCLK) ; port Wiznet_SCLK
NetU100_13: U900.32(SCSn) ; port Wiznet_nCS
NetU101_3: U900.34(MISO) ; port Wiznet_MISO

Not connected (* = marked no-connect by the designer): J900 7(NC); U900 7(DNC)* 12(NC)* 13(NC)* 18(VBG)* 23(RSVD)* 24(SPDLED)* 26(DUPLED)* 36(INTn)* 38(RSVD)* 39(RSVD)* 40(RSVD)* 41(RSVD)* 42(RSVD)* 46(NC)* 47(NC)*

### Notes on the sheet
- FPGA based Phasor Measurement Unit - W5500 Eth Controller
- (in symbol HR913550A) GREEN; YELLOW

### Library data of the parts
C900 C908 = 0805 22uF (226) 20% 25V: 贴片电容; ComponentLink1Description: 供应商链接; ComponentLink1URL: http://www.szlcsc.com/product/details_46786.html; Package: 0805; Supplier: LC; SuppliersPartNumber: C45783
C901-C907 = 0402 100nF (104) 10% 16V: 贴片电容; ComponentLink1Description: 供应商链接; ComponentLink1URL: http://www.szlcsc.com/product/details_1877.html; Package: 0402; Supplier: LC; SuppliersPartNumber: C1525
C909 C910 C915 C916 = 0402 10nF (103) 10% 50V: 贴片电容; ComponentLink1Description: 供应商链接; ComponentLink1URL: http://www.szlcsc.com/product/details_15869.html; Package: 0402; Supplier: LC; SuppliersPartNumber: C15195
C911 C912 = 0402 6.8nF (682) 10% 50V: 贴片电容; ComponentLink1Description: 供应商链接; ComponentLink1URL: http://www.szlcsc.com/product/details_1894.html; Package: 0402; Supplier: LC; SuppliersPartNumber: C1542
C913 C914 = 0402 18pF (180) 5% 50V: 贴片电容; ComponentLink1Description: 供应商链接; ComponentLink1URL: http://www.szlcsc.com/product/details_1901.html; Package: 0402; Supplier: LC; SuppliersPartNumber: C1549
C917 = 0603 4.7uF (475) 10% 16V: 贴片电容; ComponentLink1Description: 供应商链接; ComponentLink1URL: http://www.szlcsc.com/product/details_20375.html; Package: 0603; Supplier: LC; SuppliersPartNumber: C19666
FB900 = 0805 600Ω 25% 100MHz: 贴片磁珠; ComponentLink1Description: 供应商链接; ComponentLink1URL: http://www.szlcsc.com/product/details_1369.html; Package: 0805; Supplier: LC; SuppliersPartNumber: C1017
J900 = HR913550A: RJ45 12 1 Green - Yellow Through Hole Ethernet Connectors/Modular Connectors (RJ45 RJ11) RoHS; JLCPCB: NO; SuppliersPartNumber: C163507
R900-R903 = 0402 4.7KΩ (4701) 1%: 贴片电阻; ComponentLink1Description: 供应商链接; ComponentLink1URL: http://www.szlcsc.com/product/details_26643.html; Package: 0402; Supplier: LC; SuppliersPartNumber: C25900
R904 = 0402 10Ω (10R0) 1%: 贴片电阻; ComponentLink1Description: 供应商链接; ComponentLink1URL: http://www.szlcsc.com/product/details_25820.html; Package: 0402; Supplier: LC; SuppliersPartNumber: C25077
R905 R906 R913 R914 = 0402 49.9Ω (49R9) 1%: 贴片电阻; ComponentLink1Description: 供应商链接; ComponentLink1URL: http://www.szlcsc.com/product/details_25863.html; Package: 0402; Supplier: LC; SuppliersPartNumber: C25120
R907-R910 R912 = 0402 0Ω (0R0) 1%: 贴片电阻; ComponentLink1Description: 供应商链接; ComponentLink1URL: http://www.szlcsc.com/product/details_17853.html; Package: 0402; Supplier: LC; SuppliersPartNumber: C17168
R911 = 0402 1MΩ (1004) 1%: 贴片电阻; ComponentLink1Description: 供应商链接; ComponentLink1URL: http://www.szlcsc.com/product/details_26826.html; Package: 0402; Supplier: LC; SuppliersPartNumber: C26083
R915 = 0402 10KΩ (1002) 1%: 贴片电阻; ComponentLink1Description: 供应商链接; ComponentLink1URL: http://www.szlcsc.com/product/details_26487.html; Package: 0402; Supplier: LC; SuppliersPartNumber: C25744
R916 = 0402 2.4KΩ (2401) 1%: 贴片电阻; ComponentLink1Description: 供应商链接; ComponentLink1URL: http://www.szlcsc.com/product/details_26625.html; Package: 0402; Supplier: LC; SuppliersPartNumber: C25882
R917 R918 = 0603 330Ω (3300) 1%: 贴片电阻; ComponentLink1Description: 供应商链接; ComponentLink1URL: http://www.szlcsc.com/product/details_23865.html; Package: 0603; Supplier: LC; SuppliersPartNumber: C23138
U900 = W5500_[C32843]: 以太网; ComponentLink1Description: 供应商链接; ComponentLink1URL: http://www.szlcsc.com/product/details_33808.html; Package: LQFP-48_7x7x05P; Supplier: LC; SuppliersPartNumber: C32843
Y900 = SMD-3225_4P  25MHZ 12PF 10PPM: 贴片晶振; ComponentLink1Description: 供应商链接; ComponentLink1URL: http://www.szlcsc.com/product/details_9526.html; Package: SMD-3225_4P; Supplier: LC; SuppliersPartNumber: C9006